# EAGLE schematic Accumulator Control Unit rev6 (EAGLE 9.6.2)

## Sheet 1 of 6: Connectors, Power Fusing, TSAL
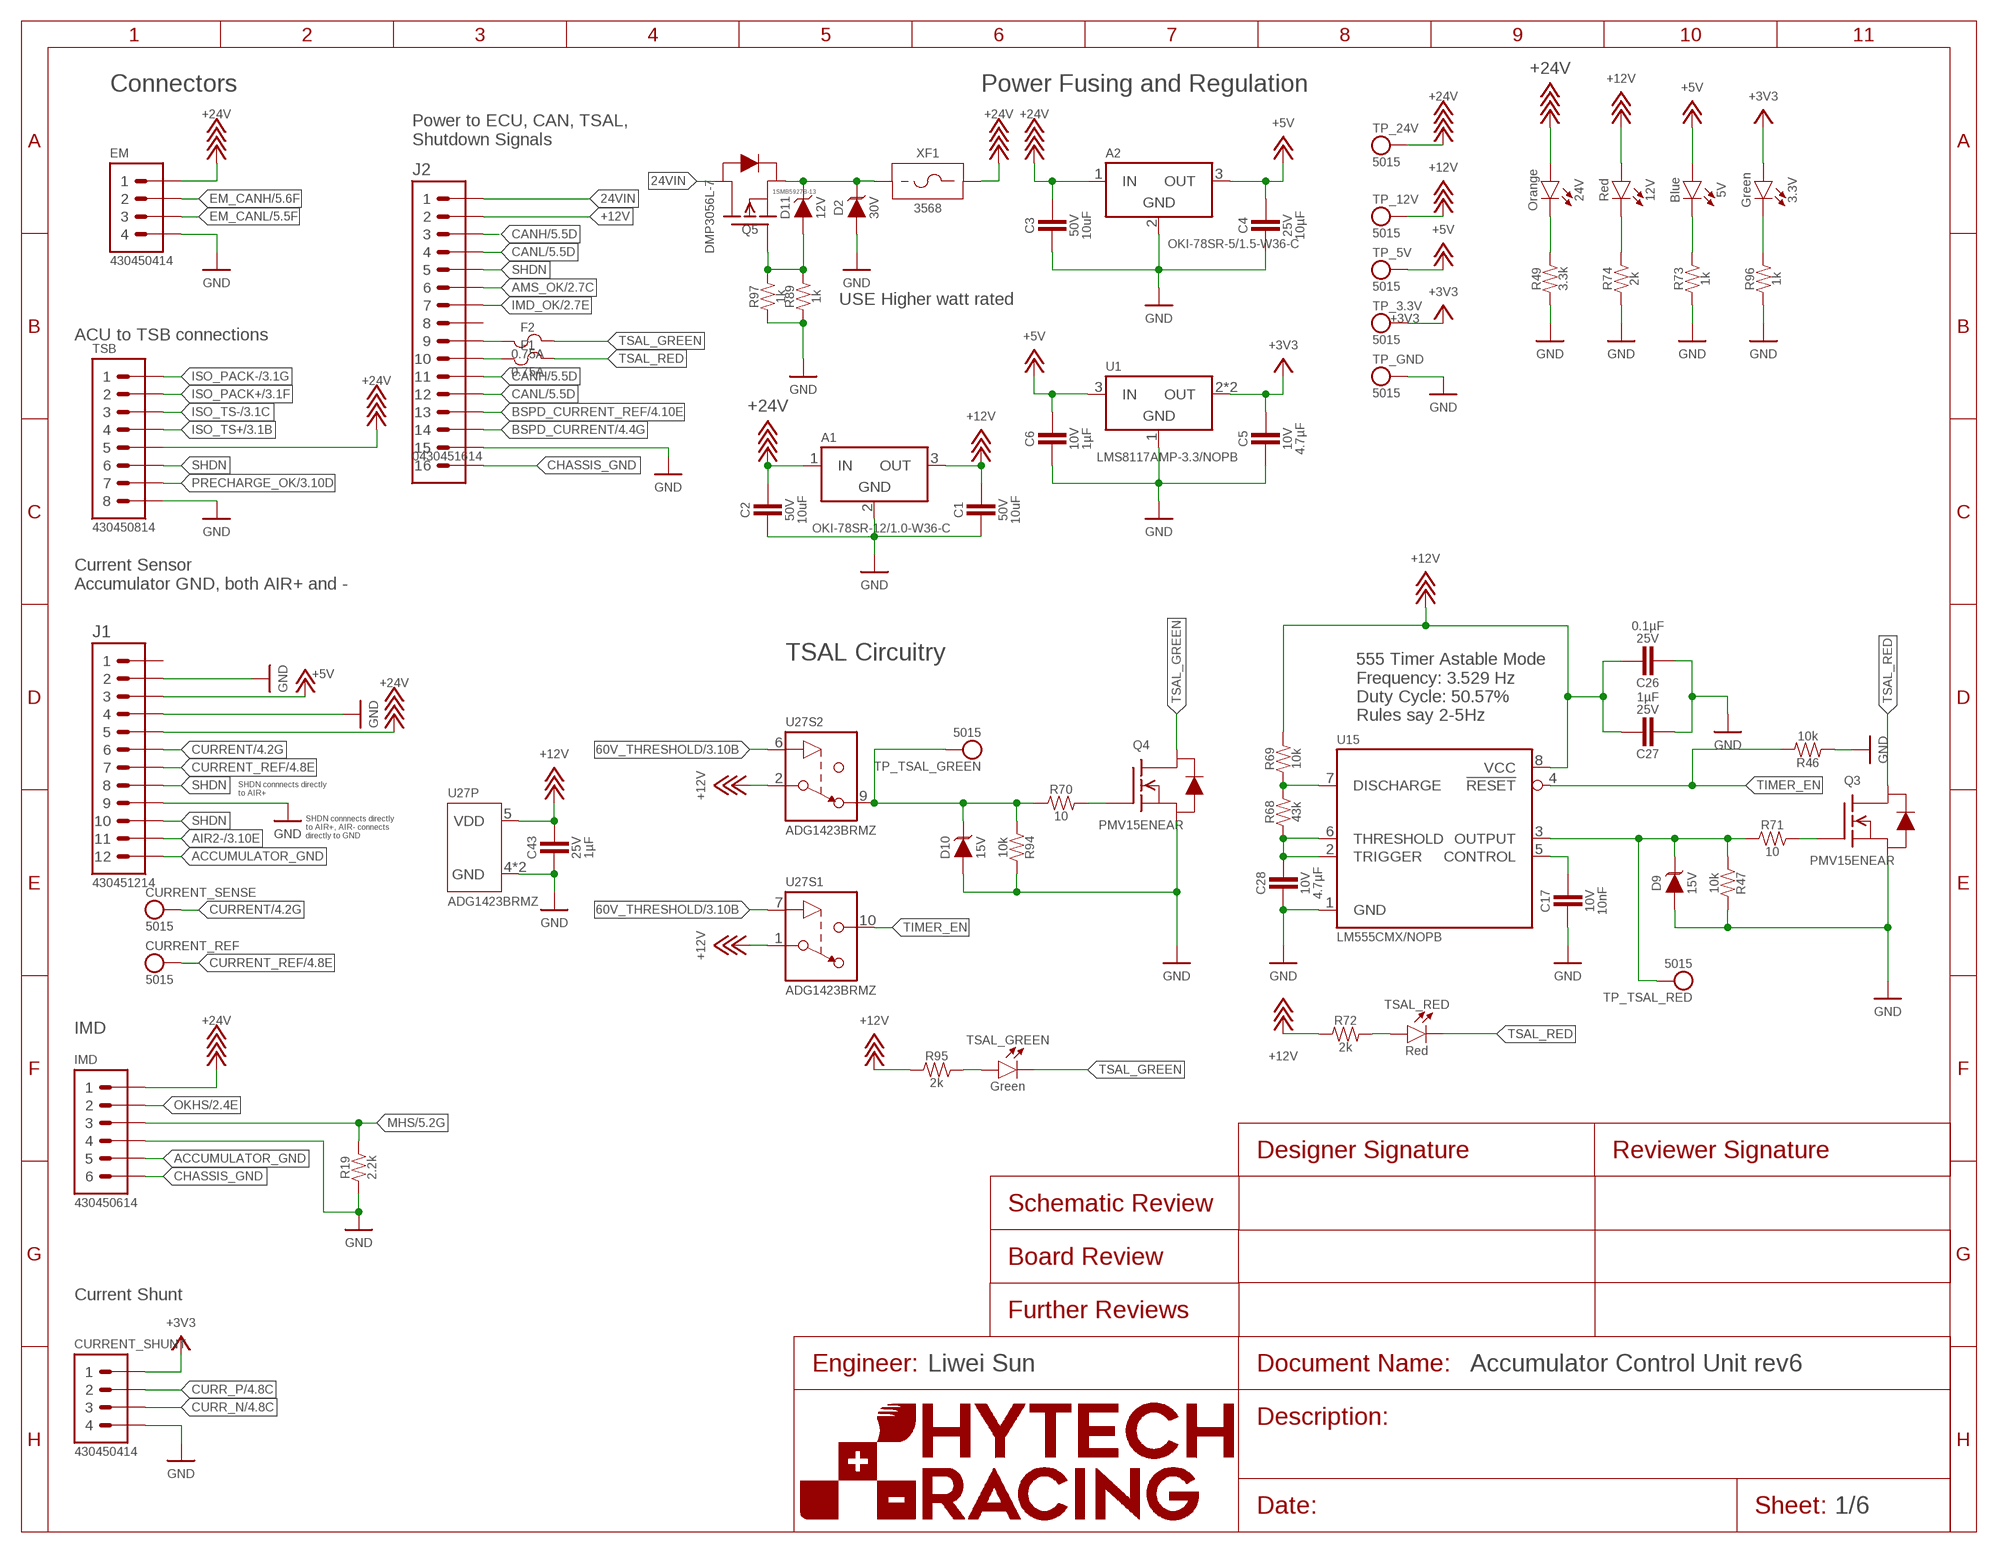
[diagram p0: schematic, sheet 1]
FRAME1 (FRAME): ENGINEER: Liwei Sun

### Parts
3.3V  LED_0603_GREEN  [0603-LED]
5V  LED_0603_BLUE  [0603-LED]
12V  LED_0603_RED  [0603-LED]
24V  LED_0603_ORANGE  [0603-LED]
A1  VOLTAGE_REGULATOR_MODULE_OKI-78SR_12V  [OKI-78SR]
A2  VOLTAGE_REGULATOR_MODULE_OKI-78SR_5V  [OKI-78SR]
C1  CAPACITOR_0805_50V_10UF  [0805-CAP]
C2  CAPACITOR_0805_50V_10UF  [0805-CAP]
C3  CAPACITOR_0805_50V_10UF  [0805-CAP]
C4  CAPACITOR_0603_25V_10UF  [0603-CAP]
C5  CAPACITOR_0603_10V_4.7UF  [0603-CAP]
C6  CAPACITOR_0603_10V_1UF  [0603-CAP]
C17  CAPACITOR_0603_10V_10NF  [0603-CAP]
C26  CAPACITOR_0603_25V_0.1UF  [0603-CAP]
C27  CAPACITOR_0603_25V_1UF  [0603-CAP]
C28  CAPACITOR_0603_10V_4.7UF  [0603-CAP]
C43  CAPACITOR_0603_25V_1UF  [0603-CAP]
CURRENT_REF  TEST_POINT  [MICRO_MINIATURE]
CURRENT_SENSE  TEST_POINT  [MICRO_MINIATURE]
CURRENT_SHUNT  CONNECTOR-4_μF_T_V_BLACK  [MOLEX_MICROFIT_PTH_VERTICAL_04_DUAL]
D2  TVS_DO-214AA_30V  [DO-214AA]
D9  TVS__15V  [SOT-23]
D10  TVS__15V  [SOT-23]
D11  ZENER_1.5SMBJ_12V  [1.5SMBJ]
EM  CONNECTOR-4_μF_T_V_BLACK  [MOLEX_MICROFIT_PTH_VERTICAL_04_DUAL]
F1  FUSE_0603_.75A  [0603-FUSE]
F2  FUSE_0603_.75A  [0603-FUSE]
IMD  CONNECTOR-6_μF_T_V_BLACK  [MOLEX_MICROFIT_PTH_VERTICAL_06_DUAL]
J1  CONNECTOR-12_MF_T_V_  [MOLEX_MICROFIT_PTH_VERTICAL_12_DUAL]
J2  CONNECTOR-16_MF_T_V_  [MOLEX_MICROFIT_PTH_VERTICAL_16_DUAL]
Q3  TRANSISTOR_N_MOS__PMV15ENEA  [SOT-23]
Q4  TRANSISTOR_N_MOS__PMV15ENEA  [SOT-23]
Q5  TRANSISTOR_P_MOS_SOT-23_DMP3056L-7  [SOT-23]
R19  RESISTOR_0603_2.2K  [0603-RES]
R46  RESISTOR_0603_10K  [0603-RES]
R47  RESISTOR_0603_10K  [0603-RES]
R49  RESISTOR_0603_3.3K  [0603-RES]
R68  RESISTOR_0603_43K  [0603-RES]
R69  RESISTOR_0603_10K  [0603-RES]
R70  RESISTOR_0603_10  [0603-RES]
R71  RESISTOR_0603_10  [0603-RES]
R72  RESISTOR_0603_2K  [0603-RES]
R73  RESISTOR_0603_1K  [0603-RES]
R74  RESISTOR_0603_2K  [0603-RES]
R89  RESISTOR_0603_1K  [0603-RES]
R94  RESISTOR_0603_10K  [0603-RES]
R95  RESISTOR_0603_2K  [0603-RES]
R96  RESISTOR_0603_1K  [0603-RES]
R97  RESISTOR_0603_1K  [0603-RES]
TP_3.3V  TEST_POINT  [5015]
TP_5V  TEST_POINT  [5015]
TP_12V  TEST_POINT  [5015]
TP_24V  TEST_POINT  [5015]
TP_GND  TEST_POINT  [5015]
TP_TSAL_GREEN  TEST_POINT  [MICRO_MINIATURE]
TP_TSAL_RED  TEST_POINT  [MICRO_MINIATURE]
TSAL_GREEN  LED_0603_GREEN  [0603-LED]
TSAL_RED  LED_0603_RED  [0603-LED]
TSB  CONNECTOR-8_μF_T_V_BLACK  [MOLEX_MICROFIT_PTH_VERTICAL_08_DUAL]
U1  VOLTAGE_REGULATOR_SOT-223_3.3V  [SOT-223]
U15  LM555  [SOIC-08(NARROW,0.15")]
U27  ADG1423  [MSOP-10]
XF1  FUSE_HOLDER_MINIBLADEPTH  [3568]

### Nets
24VIN: J2.1 Q5.3(D)
60V_THRESHOLD: U27.6(S2:IN) U27.7(S1:IN) ; also sheet 3
+3V3: 3.3V.2(A) C5.1 CURRENT_SHUNT.1 TP_3.3V.1 U1.2(OUT) U1.4(OUT) ; also sheet 4,5
+5V: 5V.2(A) A2.3(OUT) C4.1 C6.1 J1.3 TP_5V.1 U1.3(IN) ; also sheet 3,5
+12V: 12V.2(A) A1.3(OUT) C1.1 C26.1 C27.1 C43.1 J2.2 R69.2 R72.1 R95.1 TP_12V.1 U15.8(VCC) U27.1(S1:S) U27.2(S2:S) U27.5(P:VDD) ; also sheet 4
+24V: 24V.2(A) A1.1(IN) A2.1(IN) C2.1 C3.1 EM.1 IMD.1 J1.5 TP_24V.1 TSB.5 XF1.3 XF1.4 ; also sheet 2,4,5
ACCUMULATOR_GND: IMD.5 J1.12
AIR2-: J1.11 ; also sheet 3
AMS_OK: J2.6 ; also sheet 2
BSPD_CURRENT: J2.14 ; also sheet 4,5
BSPD_CURRENT_REF: J2.13 ; also sheet 4
CANH: J2.3 J2.11 ; also sheet 5
CANL: J2.4 J2.12 ; also sheet 5
CHASSIS_GND: IMD.6 J2.16
CURR_N: CURRENT_SHUNT.3 ; also sheet 4
CURR_P: CURRENT_SHUNT.2 ; also sheet 4
CURRENT: CURRENT_SENSE.1 J1.6 ; also sheet 4
CURRENT_REF: CURRENT_REF.1 J1.7 ; also sheet 4
EM_CANH: EM.2 ; also sheet 5
EM_CANL: EM.3 ; also sheet 5
GND: A1.2(GND) A2.2(GND) C1.2 C2.2 C3.2 C4.2 C5.2 C6.2 C17.2 C26.2 C27.2 C28.2 C43.2 CURRENT_SHUNT.4 D2.1(A) D9.1(A) D10.1(A) EM.4 IMD.4 J1.2 J1.4 J1.9 J2.15 Q3.2(S) Q4.2(S) R19.1 R46.1 R47.2 R49.1 R73.1 R74.1 R89.1 R94.2 R96.1 R97.1 TP_GND.1 TSB.8 U1.1(GND) U15.1(GND) U27.4(P:GND) U27.8(P:GND) ; also sheet 2,3,4,5
IMD_OK: J2.7 ; also sheet 2,5
ISO_PACK+: TSB.2 ; also sheet 3
ISO_PACK-: TSB.1 ; also sheet 3
ISO_TS+: TSB.4 ; also sheet 3
ISO_TS-: TSB.3 ; also sheet 3
MHS: IMD.3 R19.2 ; also sheet 5
N$1: 3.3V.1(C) R96.2
N$2: 5V.1(C) R73.2
N$3: C28.1 R68.1 U15.2(TRIGGER) U15.6(THRESHOLD)
N$5: C17.1 U15.5(CONTROL)
N$6: R68.2 R69.1 U15.7(DISCHARGE)
N$14: 12V.1(C) R74.2
N$18: D10.3(C) R70.1 R94.1 TP_TSAL_GREEN.1 U27.9(S2:D)
N$19: D9.3(C) R47.1 R71.1 TP_TSAL_RED.1 U15.3(OUTPUT)
N$24: R95.2 TSAL_GREEN.2(A)
N$28: F1.1 J2.10
N$31: F2.1 J2.9
N$32: 24V.1(C) R49.2
N$46: R72.2 TSAL_RED.2(A)
N$60: Q3.1(G) R71.2
N$61: Q4.1(G) R70.2
N$75: D2.2(C) D11.2(C) Q5.2(S) XF1.1 XF1.2
N$76: D11.1(A) Q5.1(G) R89.2 R97.2
OKHS: IMD.2 ; also sheet 2
PRECHARGE_OK: TSB.7 ; also sheet 3,5
SHDN: J1.8 J1.10 J2.5 TSB.6
TIMER_EN: R46.2 U15.4(!RESET) U27.10(S1:D)
TSAL_GREEN: F2.2 Q4.3(D) TSAL_GREEN.1(C)
TSAL_RED: F1.2 Q3.3(D) TSAL_RED.1(C)
Unconnected: J1.1 J2.8

### Notes on the sheet
- Connectors | Power Fusing and Regulation
- Power to ECU, CAN, TSAL, 
  Shutdown Signals
- USE Higher watt rated
- ACU to TSB connections
- Current Sensor
  Accumulator GND, both AIR+ and -
- TSAL Circuitry
- 555 Timer Astable Mode
  Frequency: 3.529 Hz
  Duty Cycle: 50.57%
  Rules say 2-5Hz
- SHDN connnects directly
  to AIR+
- SHDN connnects directly
  to AIR+, AIR- connects
  directly to GND
- IMD
- Current Shunt

## Sheet 2 of 6: Shutdown Circuitry
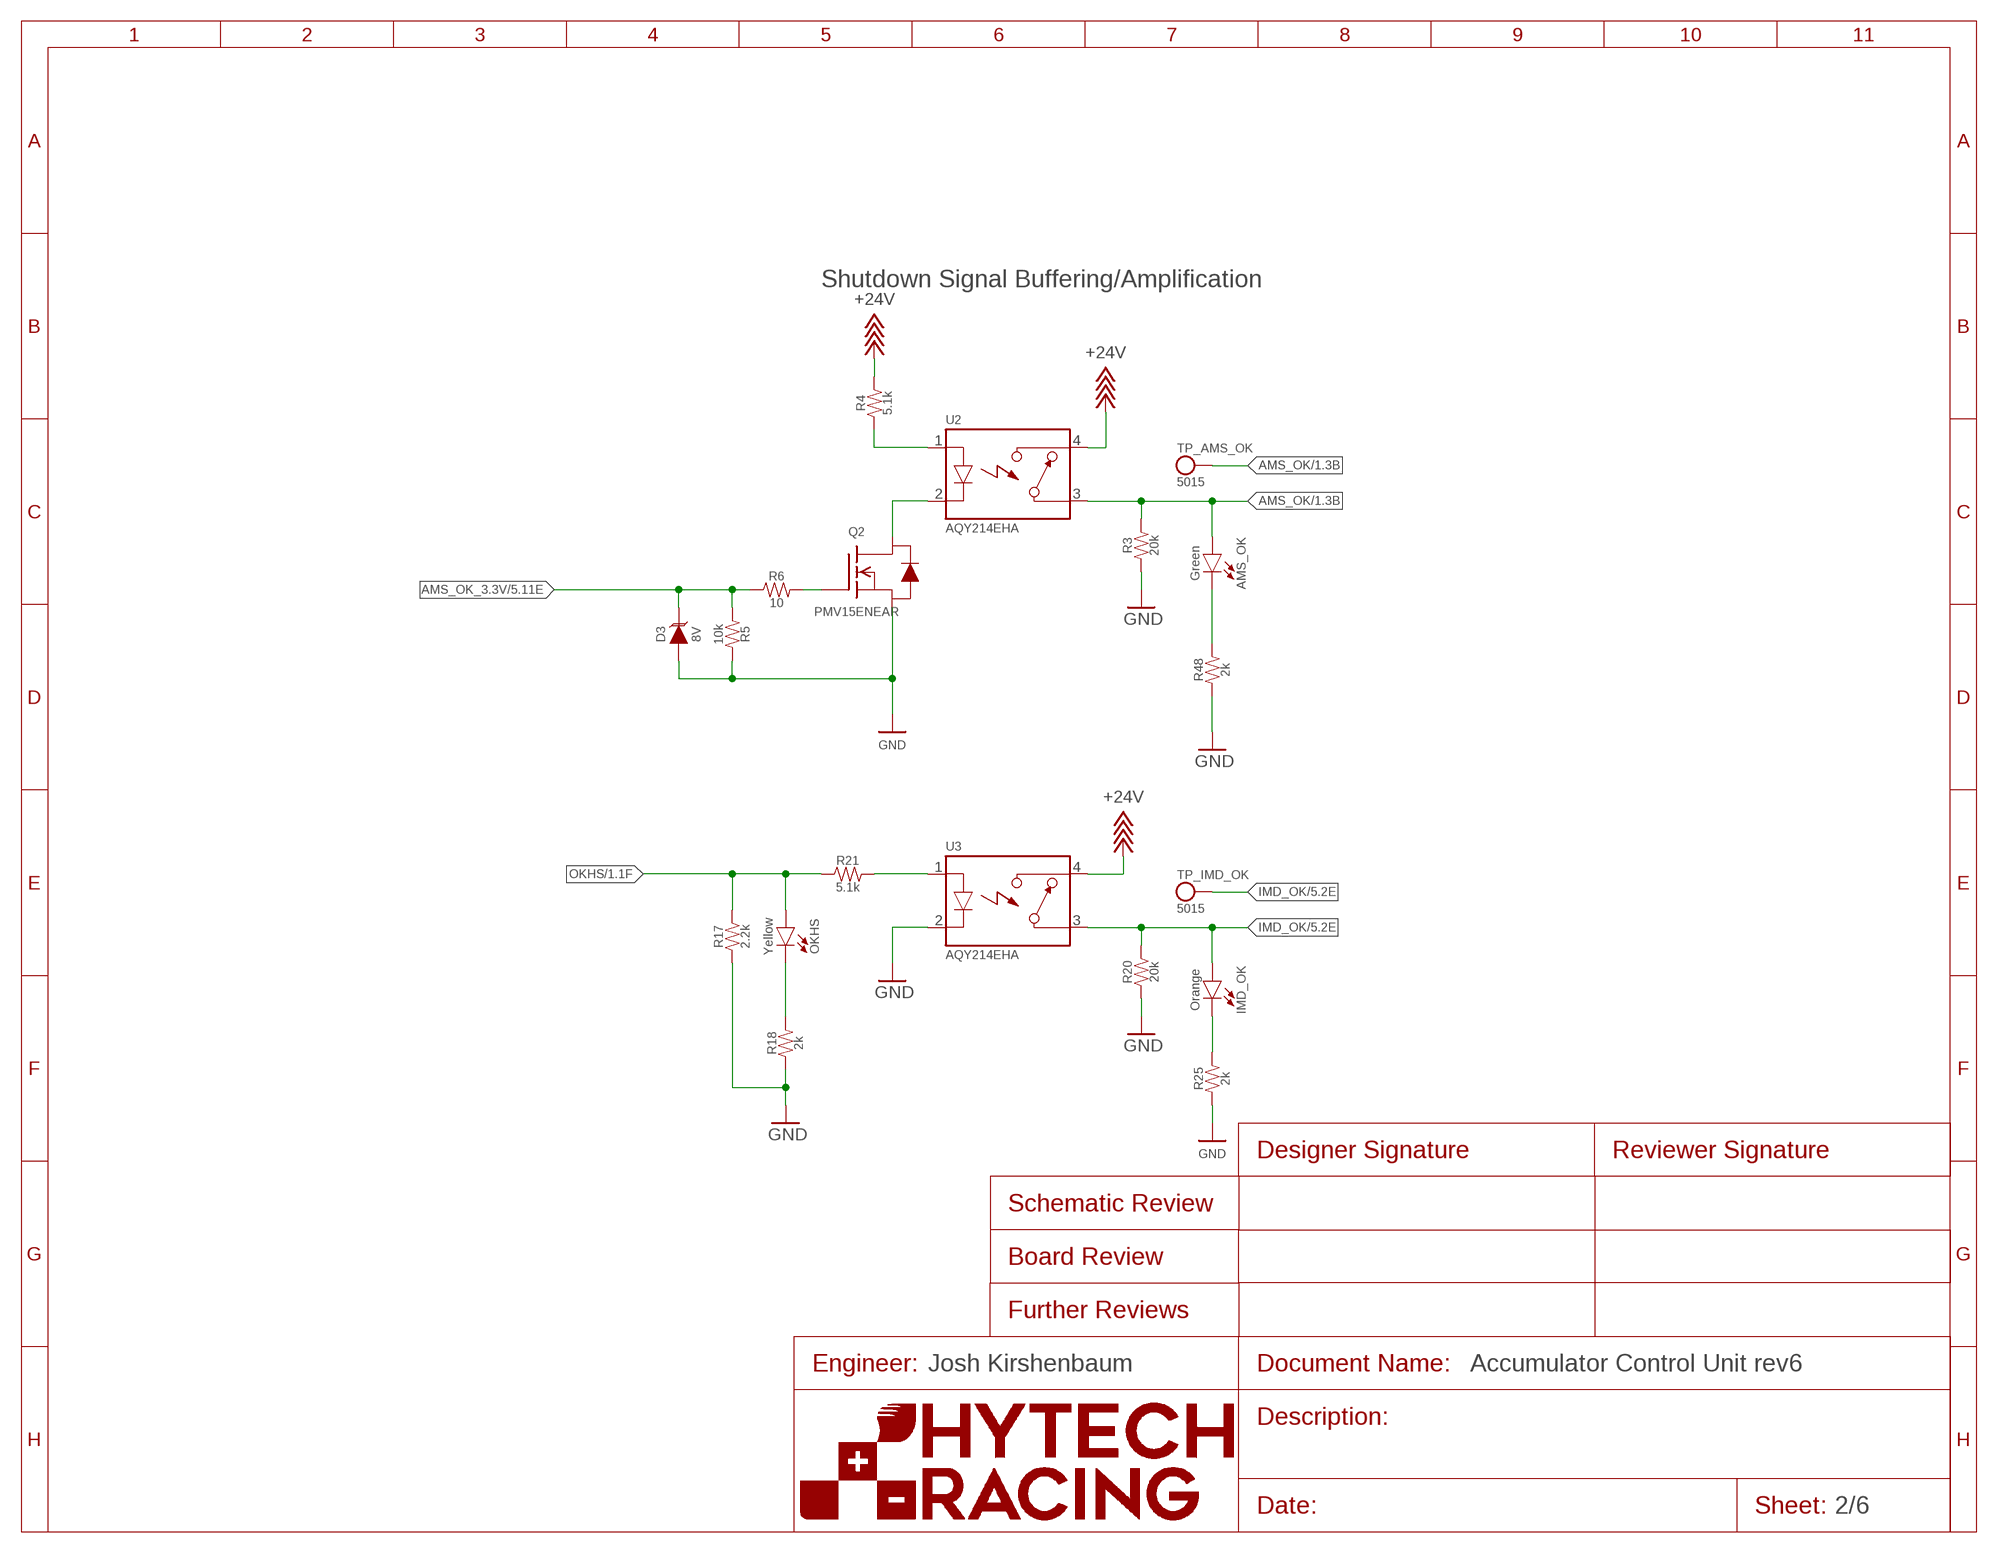
[diagram p1: schematic, sheet 2]

### Parts
AMS_OK  LED_0603_GREEN  [0603-LED]
D3  TVS__8V  [SOT-23]
IMD_OK  LED_0603_ORANGE  [0603-LED]
OKHS  LED_0603_YELLOW  [0603-LED]
Q2  TRANSISTOR_N_MOS__PMV15ENEA  [SOT-23]
R3  RESISTOR_0603_20K  [0603-RES]
R4  RESISTOR_0603_5.1K  [0603-RES]
R5  RESISTOR_0603_10K  [0603-RES]
R6  RESISTOR_0603_10  [0603-RES]
R17  RESISTOR_0603_2.2K  [0603-RES]
R18  RESISTOR_0603_2K  [0603-RES]
R20  RESISTOR_0603_20K  [0603-RES]
R21  RESISTOR_0603_5.1K  [0603-RES]
R25  RESISTOR_0603_2K  [0603-RES]
R48  RESISTOR_0603_2K  [0603-RES]
TP_AMS_OK  TEST_POINT  [MICRO_MINIATURE]
TP_IMD_OK  TEST_POINT  [MICRO_MINIATURE]
U2  RELAY_SOLIDSTATE_NO_DIP-4  [DIP-4]
U3  RELAY_SOLIDSTATE_NO_DIP-4  [DIP-4]

### Nets
+24V: R4.2 U2.4(CONTACT2) U3.4(CONTACT2) ; also sheet 1,4,5
AMS_OK: AMS_OK.2(A) R3.2 TP_AMS_OK.1 U2.3(CONTACT1) ; also sheet 1
AMS_OK_3.3V: D3.3(C) R5.1 R6.1 ; also sheet 5
GND: D3.1(A) Q2.2(S) R3.1 R5.2 R17.1 R18.1 R20.1 R25.1 R48.1 U3.2(CONTROL-) ; also sheet 1,3,4,5
IMD_OK: IMD_OK.2(A) R20.2 TP_IMD_OK.1 U3.3(CONTACT1) ; also sheet 1,5
N$8: R21.2 U3.1(CONTROL+)
N$9: OKHS.1(C) R18.2
N$16: R4.1 U2.1(CONTROL+)
N$17: AMS_OK.1(C) R48.2
N$20: Q2.3(D) U2.2(CONTROL-)
N$27: IMD_OK.1(C) R25.2
N$30: Q2.1(G) R6.2
OKHS: OKHS.2(A) R17.2 R21.1 ; also sheet 1

### Notes on the sheet
- Shutdown Signal Buffering/Amplification
- Josh Kirshenbaum

## Sheet 3 of 6: Precharge Circuit
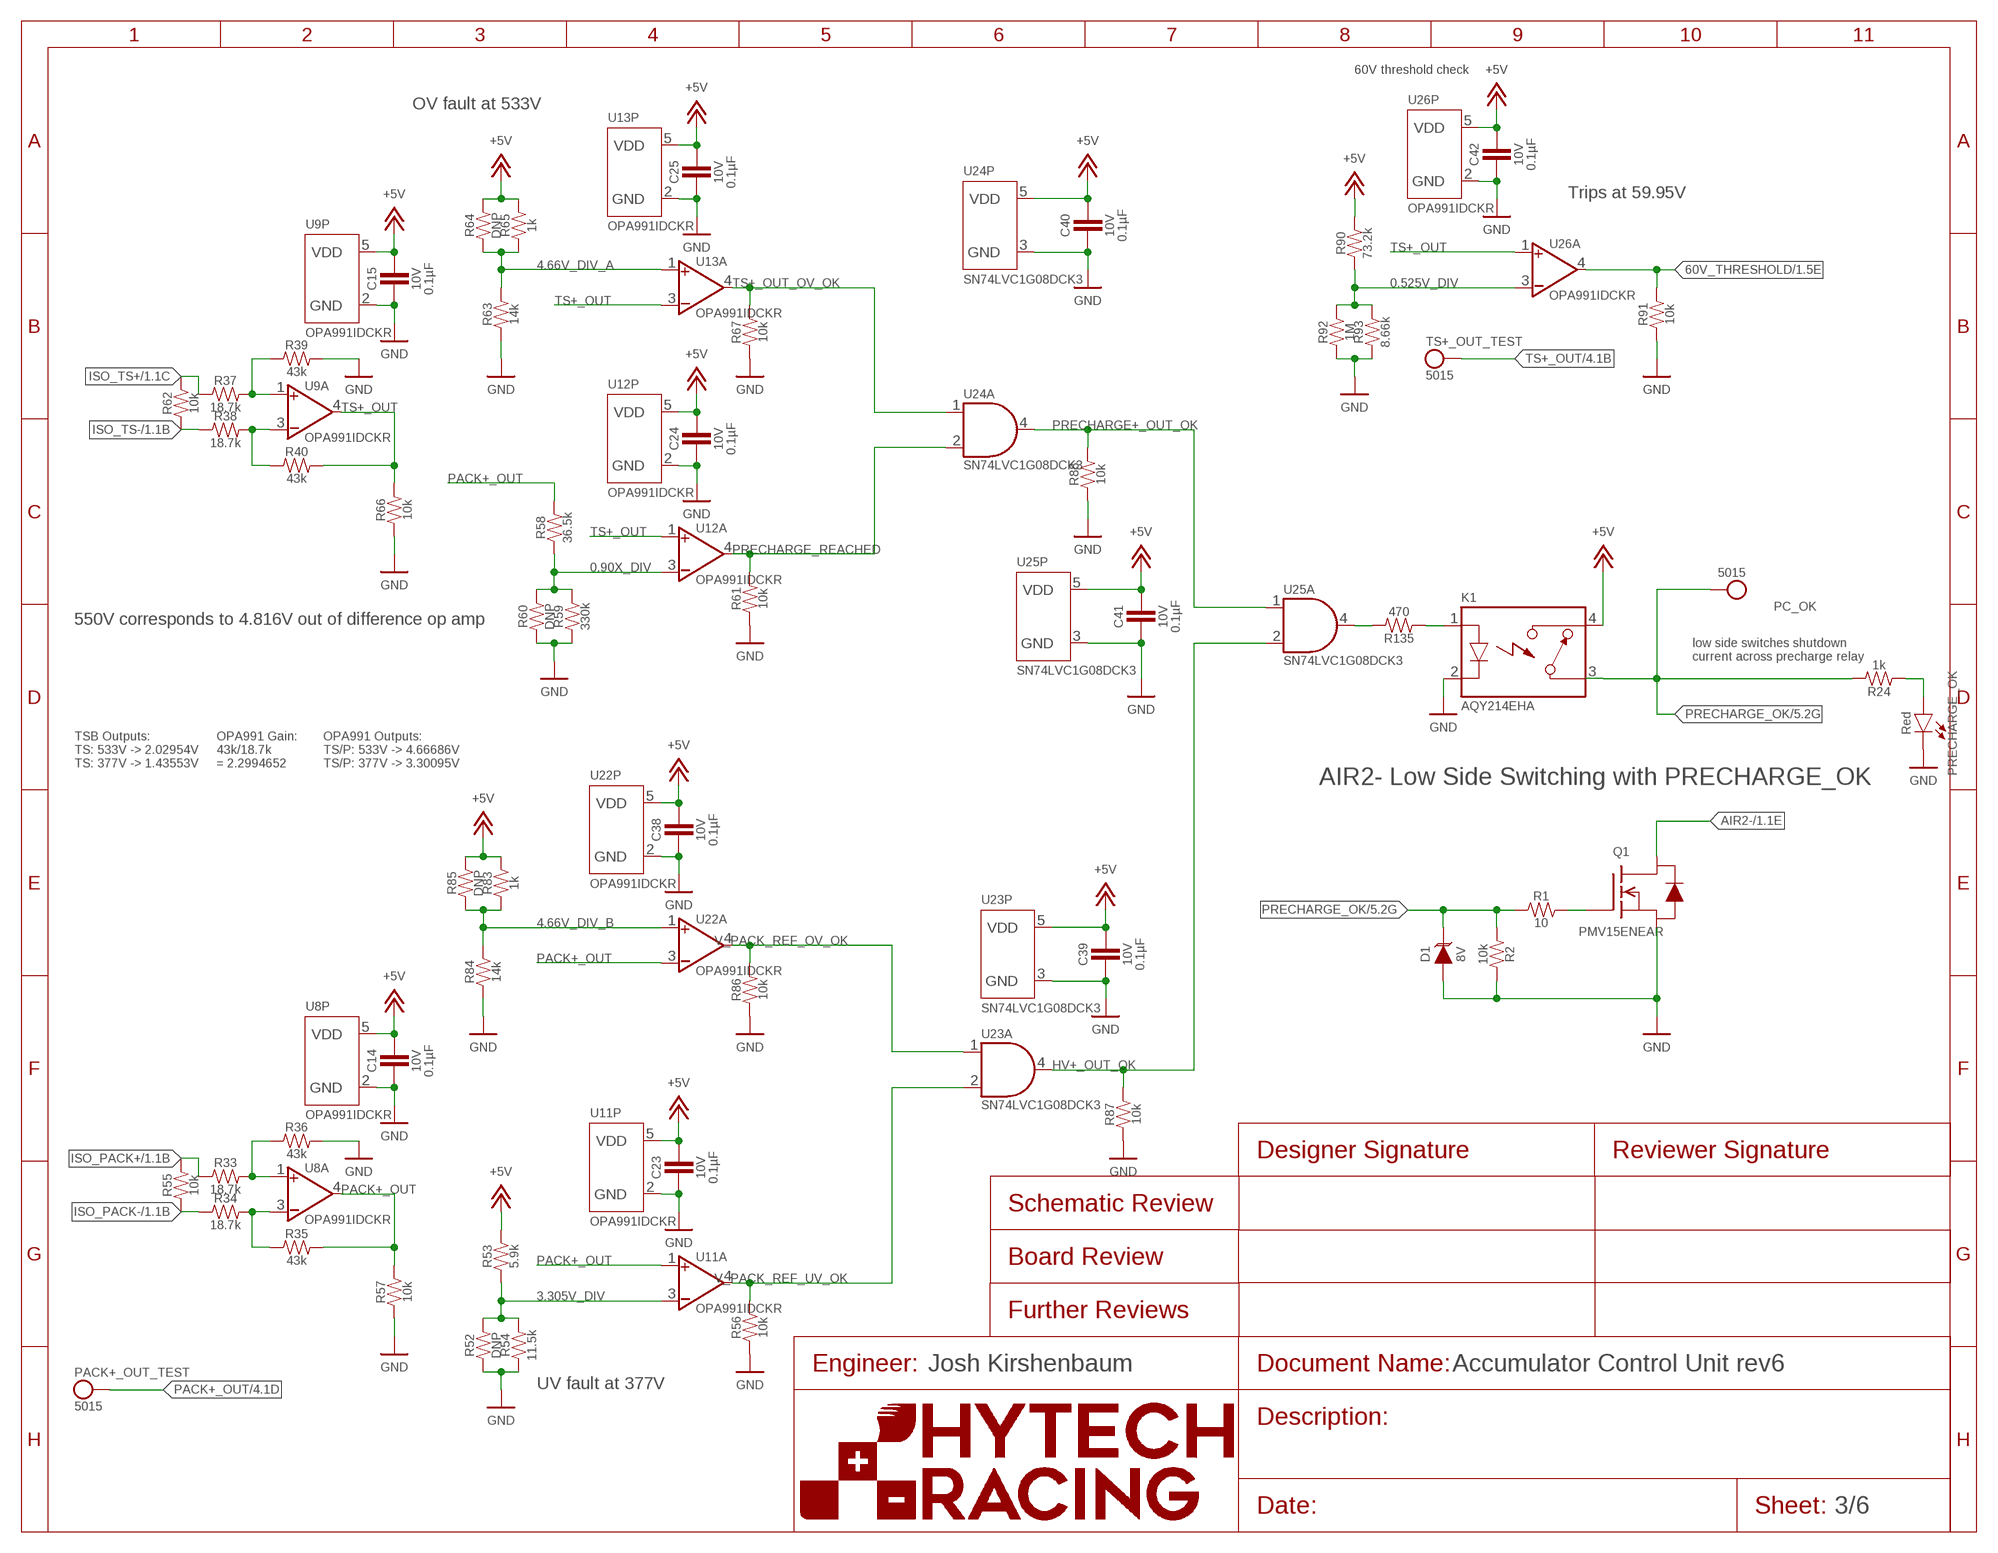
[diagram p2: schematic, sheet 3]

### Parts
C14  CAPACITOR_0603_10V_0.1UF  [0603-CAP]
C15  CAPACITOR_0603_10V_0.1UF  [0603-CAP]
C23  CAPACITOR_0603_10V_0.1UF  [0603-CAP]
C24  CAPACITOR_0603_10V_0.1UF  [0603-CAP]
C25  CAPACITOR_0603_10V_0.1UF  [0603-CAP]
C38  CAPACITOR_0603_10V_0.1UF  [0603-CAP]
C39  CAPACITOR_0603_10V_0.1UF  [0603-CAP]
C40  CAPACITOR_0603_10V_0.1UF  [0603-CAP]
C41  CAPACITOR_0603_10V_0.1UF  [0603-CAP]
C42  CAPACITOR_0603_10V_0.1UF  [0603-CAP]
D1  TVS__8V  [SOT-23]
K1  RELAY_SOLIDSTATE_NO_DIP-4  [DIP-4]
PACK+_OUT_TEST  TEST_POINT  [MICRO_MINIATURE]
PC_OK  TEST_POINT  [MICRO_MINIATURE]
PRECHARGE_OK  LED_0603_RED  [0603-LED]
Q1  TRANSISTOR_N_MOS__PMV15ENEA  [SOT-23]
R1  RESISTOR_0603_10  [0603-RES]
R2  RESISTOR_0603_10K  [0603-RES]
R24  RESISTOR_0603_1K  [0603-RES]
R33  RESISTOR_0603_18.7K_LT  [0603-RES]
R34  RESISTOR_0603_18.7K_LT  [0603-RES]
R35  RESISTOR_0603_43K_LT  [0603-RES]
R36  RESISTOR_0603_43K_LT  [0603-RES]
R37  RESISTOR_0603_18.7K_LT  [0603-RES]
R38  RESISTOR_0603_18.7K_LT  [0603-RES]
R39  RESISTOR_0603_43K_LT  [0603-RES]
R40  RESISTOR_0603_43K_LT  [0603-RES]
R52  RESISTOR_0603_DNP  [0603-RES]
R53  RESISTOR_0603_5.9K  [0603-RES]
R54  RESISTOR_0603_11.5K  [0603-RES]
R55  RESISTOR_0603_10K  [0603-RES]
R56  RESISTOR_0603_10K  [0603-RES]
R57  RESISTOR_0603_10K  [0603-RES]
R58  RESISTOR_0603_36.5K  [0603-RES]
R59  RESISTOR_0603_330K  [0603-RES]
R60  RESISTOR_0603_DNP  [0603-RES]
R61  RESISTOR_0603_10K  [0603-RES]
R62  RESISTOR_0603_10K  [0603-RES]
R63  RESISTOR_0603_14K  [0603-RES]
R64  RESISTOR_0603_DNP  [0603-RES]
R65  RESISTOR_0603_1K  [0603-RES]
R66  RESISTOR_0603_10K  [0603-RES]
R67  RESISTOR_0603_10K  [0603-RES]
R83  RESISTOR_0603_1K  [0603-RES]
R84  RESISTOR_0603_14K  [0603-RES]
R85  RESISTOR_0603_DNP  [0603-RES]
R86  RESISTOR_0603_10K  [0603-RES]
R87  RESISTOR_0603_10K  [0603-RES]
R88  RESISTOR_0603_10K  [0603-RES]
R90  RESISTOR_0603_73.2K  [0603-RES]
R91  RESISTOR_0603_10K  [0603-RES]
R92  RESISTOR_0603_1M  [0603-RES]
R93  RESISTOR_0603_8.66K  [0603-RES]
R135  RESISTOR_0603_470  [0603-RES]
TS+_OUT_TEST  TEST_POINT  [MICRO_MINIATURE]
U8  OPAMP_1_CHANNEL_OPA991  [SC-70-5]
U9  OPAMP_1_CHANNEL_OPA991  [SC-70-5]
U11  OPAMP_1_CHANNEL_OPA991  [SC-70-5]
U12  OPAMP_1_CHANNEL_OPA991  [SC-70-5]
U13  OPAMP_1_CHANNEL_OPA991  [SC-70-5]
U22  OPAMP_1_CHANNEL_OPA991  [SC-70-5]
U23  LOGICGATE_AND_DCK3  [SC-70-5]
U24  LOGICGATE_AND_DCK3  [SC-70-5]
U25  LOGICGATE_AND_DCK3  [SC-70-5]
U26  OPAMP_1_CHANNEL_OPA991  [SC-70-5]

### Nets
0.90X_DIV: R58.1 R59.2 R60.2 U12.3(A:VIN-)
0.525V_DIV: R90.1 R92.2 R93.2 U26.3(A:VIN-)
3.305V_DIV: R52.2 R53.1 R54.2 U11.3(A:VIN-)
4.66V_DIV_A: R63.2 R64.1 R65.1 U13.1(A:VIN+)
4.66V_DIV_B: R83.1 R84.2 R85.1 U22.1(A:VIN+)
60V_THRESHOLD: R91.2 U26.4(A:VOUT) ; also sheet 1
+5V: C14.1 C15.1 C23.1 C24.1 C25.1 C38.1 C39.1 C40.1 C41.1 C42.1 K1.4(CONTACT2) R53.2 R64.2 R65.2 R83.2 R85.2 R90.2 U8.5(P:VDD) U9.5(P:VDD) U11.5(P:VDD) U12.5(P:VDD) U13.5(P:VDD) U22.5(P:VDD) U23.5(P:VDD) U24.5(P:VDD) U25.5(P:VDD) U26.5(P:VDD) ; also sheet 1,5
AIR2-: Q1.3(D) ; also sheet 1
GND: C14.2 C15.2 C23.2 C24.2 C25.2 C38.2 C39.2 C40.2 C41.2 C42.2 D1.1(A) K1.2(CONTROL-) PRECHARGE_OK.1(C) Q1.2(S) R2.2 R36.2 R39.2 R52.1 R54.1 R56.1 R57.1 R59.1 R60.1 R61.1 R63.1 R66.1 R67.1 R84.1 R86.1 R87.1 R88.1 R91.1 R92.1 R93.1 U8.2(P:GND) U9.2(P:GND) U11.2(P:GND) U12.2(P:GND) U13.2(P:GND) U22.2(P:GND) U23.3(P:GND) U24.3(P:GND) U25.3(P:GND) U26.2(P:GND) ; also sheet 1,2,4,5
HV+_OUT_OK: R87.2 U23.4(A:OUT) U25.2(A:IN2)
ISO_PACK+: R33.1 R55.2 ; also sheet 1
ISO_PACK-: R34.1 R55.1 ; also sheet 1
ISO_TS+: R37.1 R62.2 ; also sheet 1
ISO_TS-: R38.1 R62.1 ; also sheet 1
N$4: PRECHARGE_OK.2(A) R24.1
N$7: Q1.1(G) R1.2
N$10: R37.2 R39.1 U9.1(A:VIN+)
N$11: R38.2 R40.1 U9.3(A:VIN-)
N$22: R33.2 R36.1 U8.1(A:VIN+)
N$23: R34.2 R35.1 U8.3(A:VIN-)
N$35: K1.1(CONTROL+) R135.1
N$41: R135.2 U25.4(A:OUT)
PACK+_OUT: PACK+_OUT_TEST.1 R35.2 R57.2 R58.2 U8.4(A:VOUT) U11.1(A:VIN+) U22.3(A:VIN-) ; also sheet 4
PRECHARGE+_OUT_OK: R88.2 U24.4(A:OUT) U25.1(A:IN1)
PRECHARGE_OK: D1.3(C) K1.3(CONTACT1) PC_OK.1 R1.1 R2.1 R24.2 ; also sheet 1,5
PRECHARGE_REACHED: R61.2 U12.4(A:VOUT) U24.2(A:IN2)
TS+_OUT: R40.2 R66.2 TS+_OUT_TEST.1 U9.4(A:VOUT) U12.1(A:VIN+) U13.3(A:VIN-) U26.1(A:VIN+) ; also sheet 4
TS+_OUT_OV_OK: R67.2 U13.4(A:VOUT) U24.1(A:IN1)
V_PACK_REF_OV_OK: R86.2 U22.4(A:VOUT) U23.1(A:IN1)
V_PACK_REF_UV_OK: R56.2 U11.4(A:VOUT) U23.2(A:IN2)

### Notes on the sheet
- 60V threshold check
- OV fault at 533V
- Trips at 59.95V
- 550V corresponds to 4.816V out of difference op amp
- low side switches shutdown 
  current across precharge relay
- TSB Outputs:
  TS: 533V -> 2.02954V
  TS: 377V -> 1.43553V
- OPA991 Gain:
  43k/18.7k 
  = 2.2994652
- OPA991 Outputs:
  TS/P: 533V -> 4.66686V
  TS/P: 377V -> 3.30095V
- AIR2- Low Side Switching with PRECHARGE_OK
- Josh Kirshenbaum
- UV fault at 377V

## Sheet 4 of 6: Analog Filtering
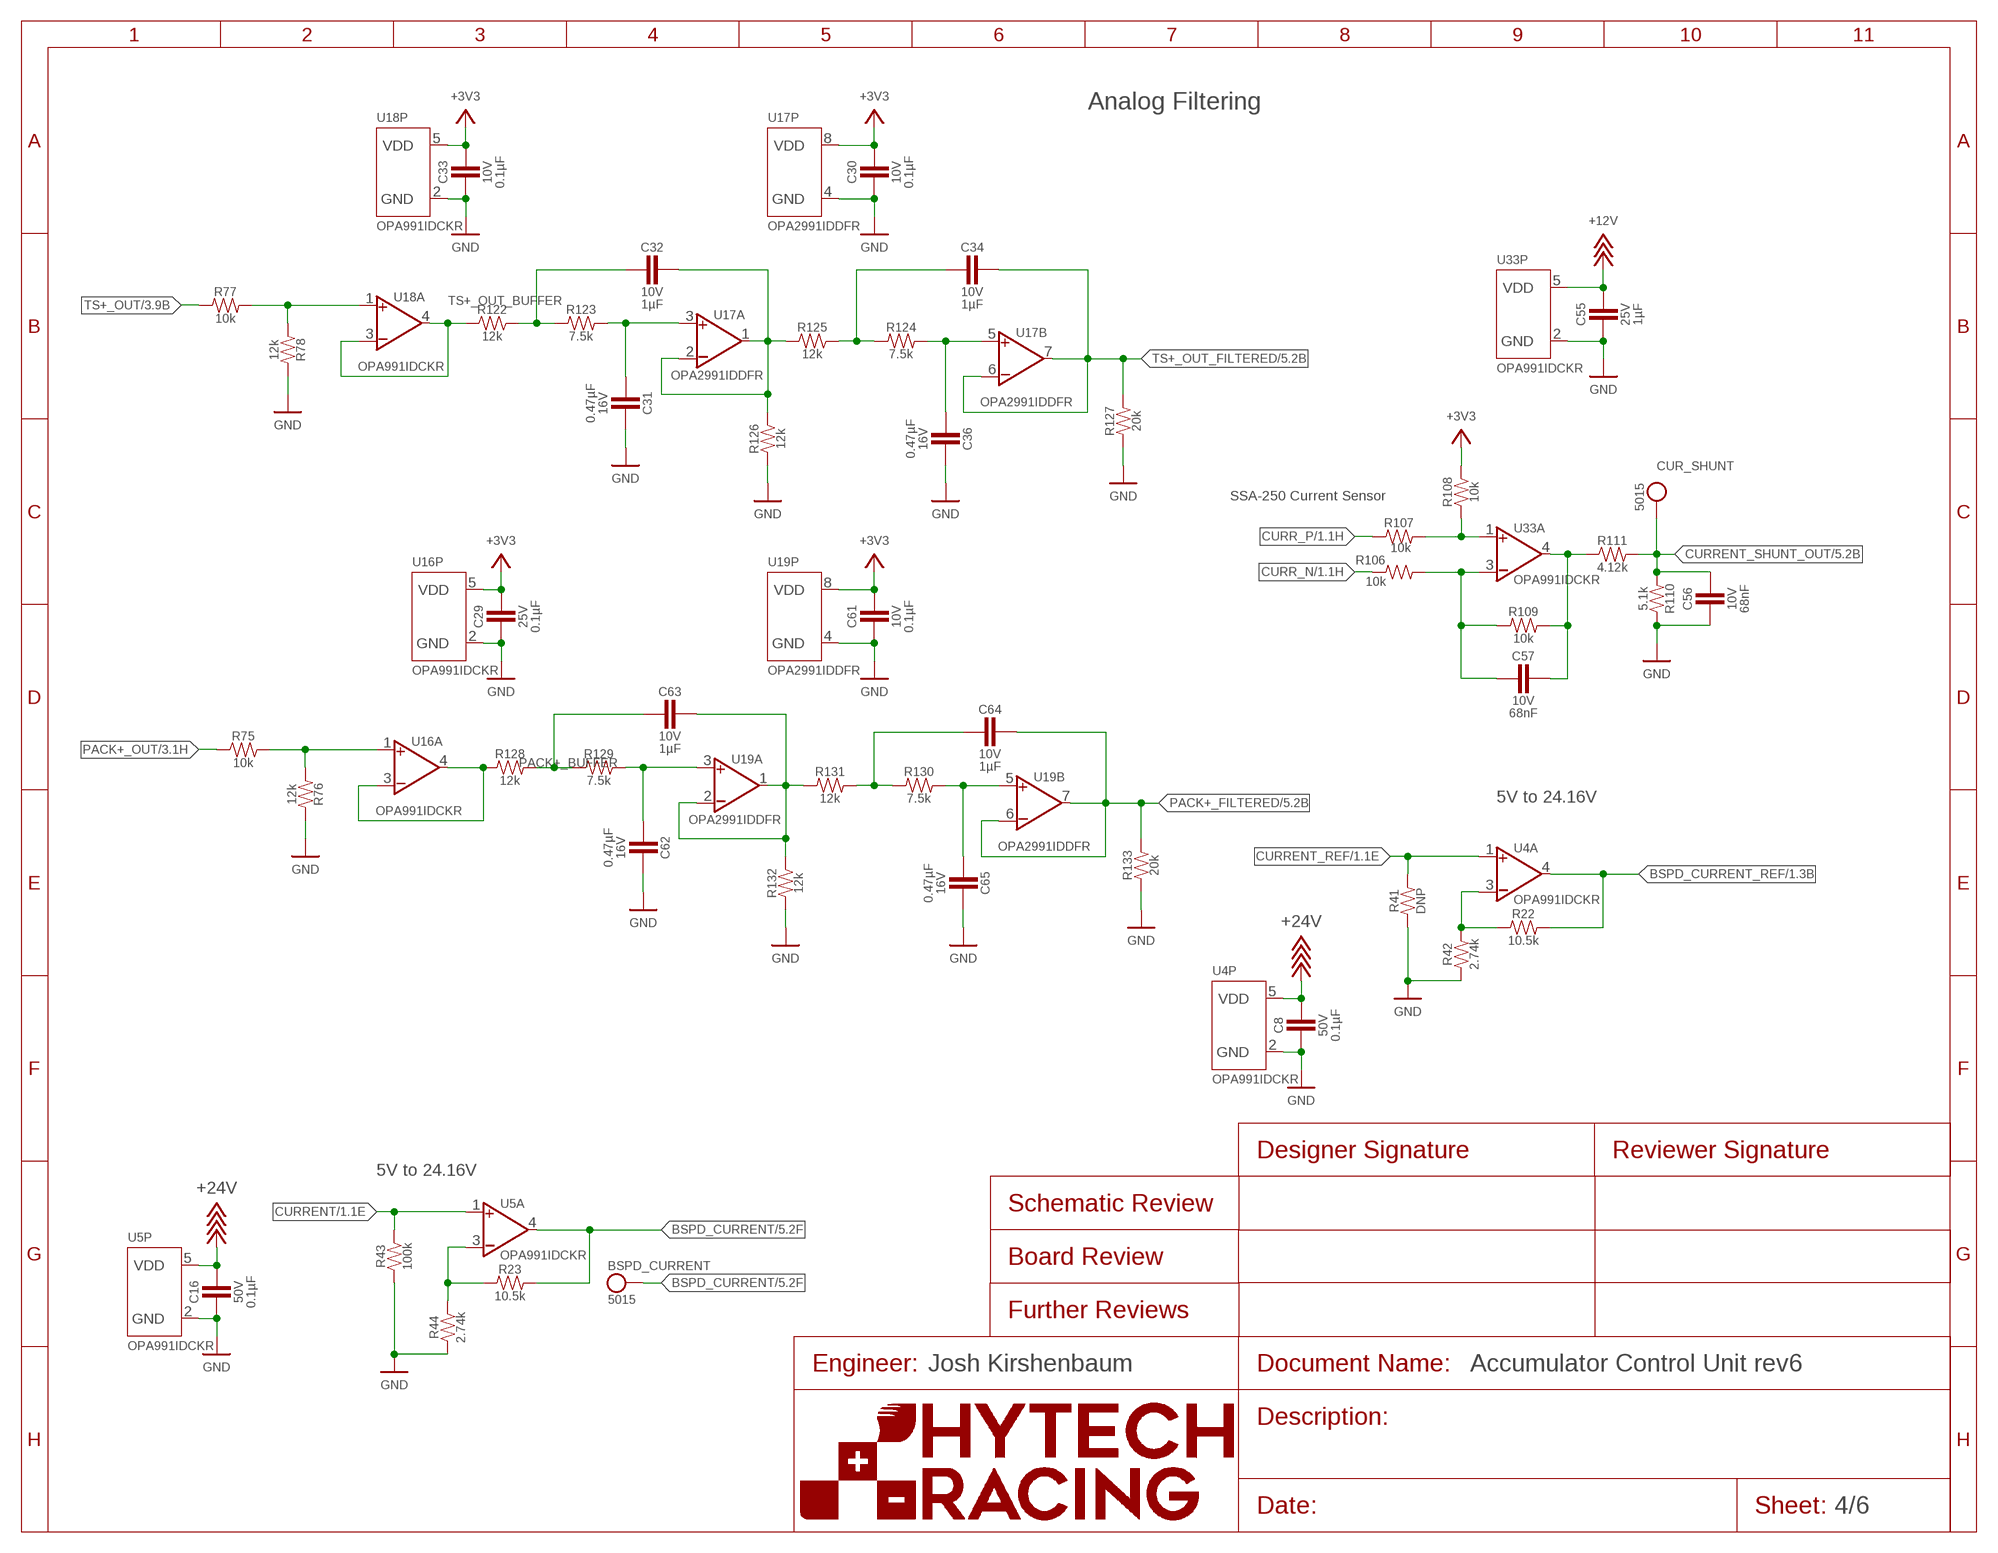
[diagram p3: schematic, sheet 4]

### Parts
BSPD_CURRENT  TEST_POINT  [MICRO_MINIATURE]
C8  CAPACITOR_0603_50V_0.1UF  [0603-CAP]
C16  CAPACITOR_0603_50V_0.1UF  [0603-CAP]
C29  CAPACITOR_0603_25V_0.1UF  [0603-CAP]
C30  CAPACITOR_0603_10V_0.1UF  [0603-CAP]
C31  CAPACITOR_0603_16V_0.47UF  [0603-CAP]
C32  CAPACITOR_0603_10V_1UF  [0603-CAP]
C33  CAPACITOR_0603_10V_0.1UF  [0603-CAP]
C34  CAPACITOR_0603_10V_1UF  [0603-CAP]
C36  CAPACITOR_0603_16V_0.47UF  [0603-CAP]
C55  CAPACITOR_0603_25V_1UF  [0603-CAP]
C56  CAPACITOR_0603_10V_68NF  [0603-CAP]
C57  CAPACITOR_0603_10V_68NF  [0603-CAP]
C61  CAPACITOR_0603_10V_0.1UF  [0603-CAP]
C62  CAPACITOR_0603_16V_0.47UF  [0603-CAP]
C63  CAPACITOR_0603_10V_1UF  [0603-CAP]
C64  CAPACITOR_0603_10V_1UF  [0603-CAP]
C65  CAPACITOR_0603_16V_0.47UF  [0603-CAP]
CUR_SHUNT  TEST_POINT  [5015]
R22  RESISTOR_0603_10.5K  [0603-RES]
R23  RESISTOR_0603_10.5K  [0603-RES]
R41  RESISTOR_0603_DNP  [0603-RES]
R42  RESISTOR_0603_2.74K  [0603-RES]
R43  RESISTOR_0603_100K  [0603-RES]
R44  RESISTOR_0603_2.74K  [0603-RES]
R75  RESISTOR_0603_10K  [0603-RES]
R76  RESISTOR_0603_12K  [0603-RES]
R77  RESISTOR_0603_10K  [0603-RES]
R78  RESISTOR_0603_12K  [0603-RES]
R106  RESISTOR_0603_10K  [0603-RES]
R107  RESISTOR_0603_10K  [0603-RES]
R108  RESISTOR_0603_10K  [0603-RES]
R109  RESISTOR_0603_10K  [0603-RES]
R110  RESISTOR_0603_5.1K  [0603-RES]
R111  RESISTOR_0603_4.12K  [0603-RES]
R122  RESISTOR_0603_12K  [0603-RES]
R123  RESISTOR_0603_7.5K  [0603-RES]
R124  RESISTOR_0603_7.5K  [0603-RES]
R125  RESISTOR_0603_12K  [0603-RES]
R126  RESISTOR_0603_12K  [0603-RES]
R127  RESISTOR_0603_20K  [0603-RES]
R128  RESISTOR_0603_12K  [0603-RES]
R129  RESISTOR_0603_7.5K  [0603-RES]
R130  RESISTOR_0603_7.5K  [0603-RES]
R131  RESISTOR_0603_12K  [0603-RES]
R132  RESISTOR_0603_12K  [0603-RES]
R133  RESISTOR_0603_20K  [0603-RES]
U4  OPAMP_1_CHANNEL_OPA991  [SC-70-5]
U5  OPAMP_1_CHANNEL_OPA991  [SC-70-5]
U16  OPAMP_1_CHANNEL_OPA991  [SC-70-5]
U17  OPAMP_2_CHANNEL_OPA_2991  [SOT-23-8]
U18  OPAMP_1_CHANNEL_OPA991  [SC-70-5]
U19  OPAMP_2_CHANNEL_OPA_2991  [SOT-23-8]
U33  OPAMP_1_CHANNEL_OPA991  [SC-70-5]

### Nets
+3V3: C29.1 C30.1 C33.1 C61.1 R108.2 U16.5(P:VDD) U17.8(P:VDD) U18.5(P:VDD) U19.8(P:VDD) ; also sheet 1,5
+12V: C55.1 U33.5(P:VDD) ; also sheet 1
+24V: C8.1 C16.1 U4.5(P:VDD) U5.5(P:VDD) ; also sheet 1,2,5
BSPD_CURRENT: BSPD_CURRENT.1 R23.2 U5.4(A:VOUT) ; also sheet 1,5
BSPD_CURRENT_REF: R22.2 U4.4(A:VOUT) ; also sheet 1
CURR_N: R106.1 ; also sheet 1
CURR_P: R107.1 ; also sheet 1
CURRENT: R43.2 U5.1(A:VIN+) ; also sheet 1
CURRENT_REF: R41.2 U4.1(A:VIN+) ; also sheet 1
CURRENT_SHUNT_OUT: C56.1 CUR_SHUNT.1 R110.1 R111.2 ; also sheet 5
GND: C8.2 C16.2 C29.2 C30.2 C31.2 C33.2 C36.2 C55.2 C56.2 C61.2 C62.2 C65.2 R41.1 R42.1 R43.1 R44.1 R76.2 R78.2 R110.2 R126.1 R127.1 R132.1 R133.1 U4.2(P:GND) U5.2(P:GND) U16.2(P:GND) U17.4(P:GND) U18.2(P:GND) U19.4(P:GND) U33.2(P:GND) ; also sheet 1,2,3,5
N$12: R23.1 R44.2 U5.3(A:VIN-)
N$26: C34.2 R124.1 R125.2
N$33: R22.1 R42.2 U4.3(A:VIN-)
N$45: C36.1 R124.2 U17.5(B:VIN+)
N$48: R77.2 R78.1 U18.1(A:VIN+)
N$50: C32.2 R122.2 R123.1
N$56: C32.1 R125.1 R126.2 U17.1(A:VOUT) U17.2(A:VIN-)
N$57: C31.1 R123.2 U17.3(A:VIN+)
N$58: R75.2 R76.1 U16.1(A:VIN+)
N$63: R107.2 R108.1 U33.1(A:VIN+)
N$64: C57.2 R106.2 R109.1 U33.3(A:VIN-)
N$67: C57.1 R109.2 R111.1 U33.4(A:VOUT)
N$70: C64.2 R130.1 R131.2
N$71: C65.1 R130.2 U19.5(B:VIN+)
N$72: C63.2 R128.2 R129.1
N$73: C63.1 R131.1 R132.2 U19.1(A:VOUT) U19.2(A:VIN-)
N$74: C62.1 R129.2 U19.3(A:VIN+)
PACK+_BUFFER: R128.1 U16.3(A:VIN-) U16.4(A:VOUT)
PACK+_FILTERED: C64.1 R133.2 U19.6(B:VIN-) U19.7(B:VOUT) ; also sheet 5
PACK+_OUT: R75.1 ; also sheet 3
TS+_OUT: R77.1 ; also sheet 3
TS+_OUT_BUFFER: R122.1 U18.3(A:VIN-) U18.4(A:VOUT)
TS+_OUT_FILTERED: C34.1 R127.2 U17.6(B:VIN-) U17.7(B:VOUT) ; also sheet 5

### Notes on the sheet
- Analog Filtering
- SSA-250 Current Sensor
- 5V to 24.16V
- 5V to 24.16V
- Josh Kirshenbaum

## Sheet 5 of 6: Teensy, LTC6820, CAN, Watchdog
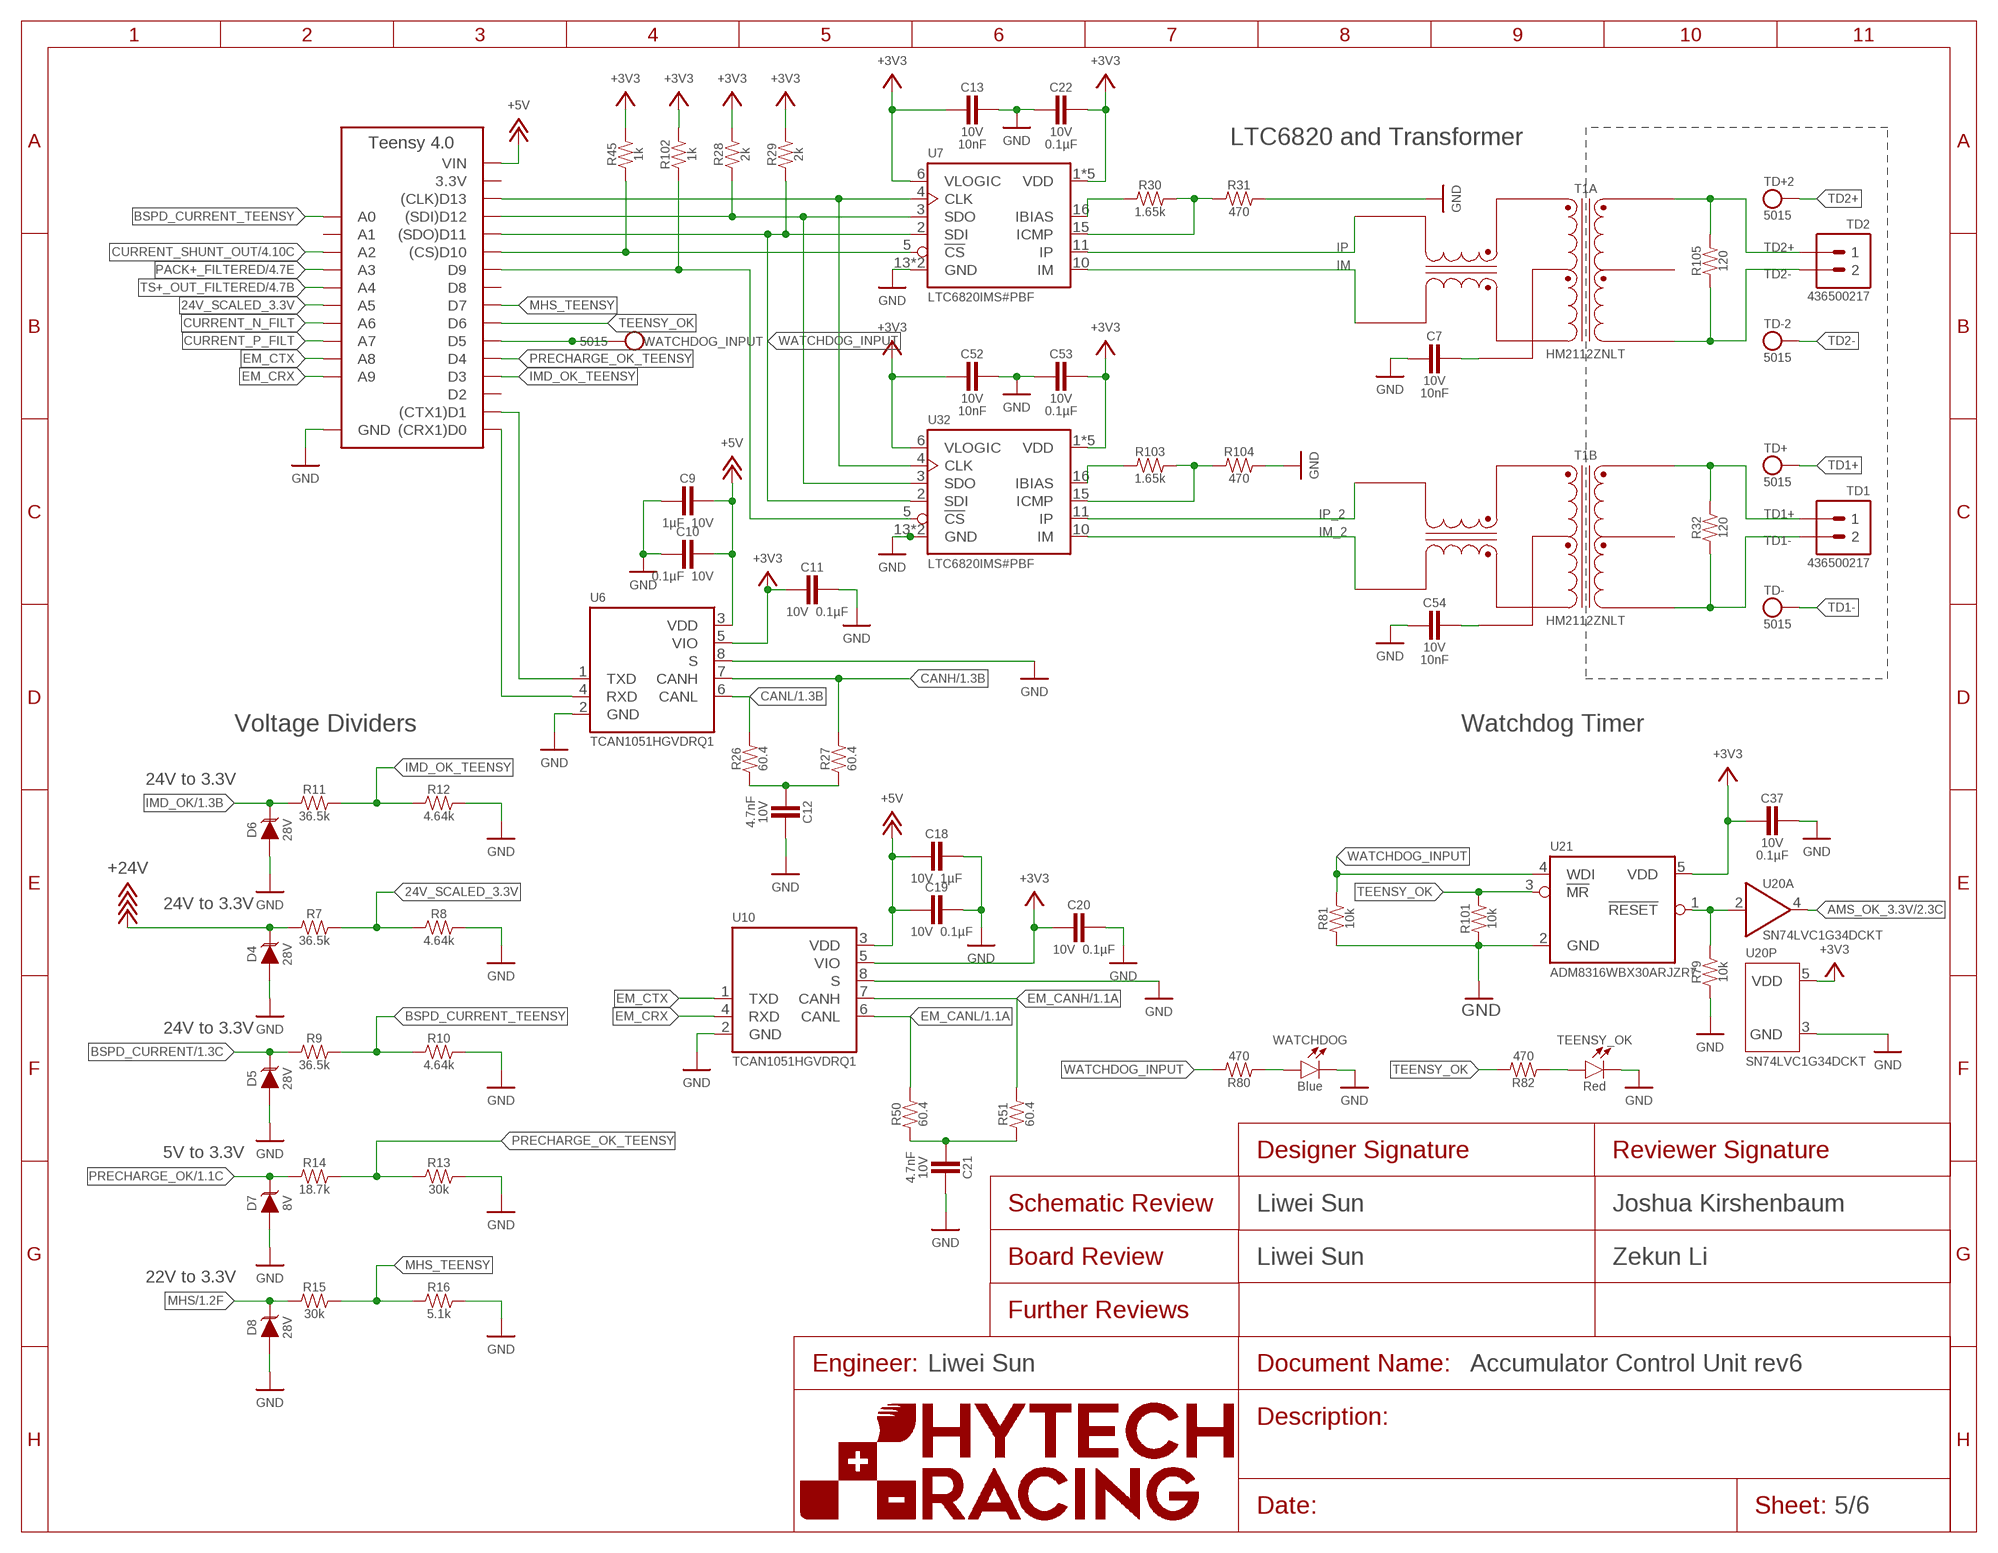
[diagram p4: schematic, sheet 5]
FRAME3 (FRAME): DESIGNER_BOARD: Liwei Sun; DESIGNER_SCHEMATIC: Liwei Sun; ENGINEER: Liwei Sun; REVIEWER_BOARD: Zekun Li; REVIEWER_SCHEMATIC: Joshua Kirshenbaum

### Parts
A3  TEENSY_4.0TH  [TEENSY_SHORT]
C7  CAPACITOR_0603_10V_10NF  [0603-CAP]
C9  CAPACITOR_0603_10V_1UF  [0603-CAP]
C10  CAPACITOR_0603_10V_0.1UF  [0603-CAP]
C11  CAPACITOR_0603_10V_0.1UF  [0603-CAP]
C12  CAPACITOR_0603_10V_4.7NF  [0603-CAP]
C13  CAPACITOR_0603_10V_10NF  [0603-CAP]
C18  CAPACITOR_0603_10V_1UF  [0603-CAP]
C19  CAPACITOR_0603_10V_0.1UF  [0603-CAP]
C20  CAPACITOR_0603_10V_0.1UF  [0603-CAP]
C21  CAPACITOR_0603_10V_4.7NF  [0603-CAP]
C22  CAPACITOR_0603_10V_0.1UF  [0603-CAP]
C37  CAPACITOR_0603_10V_0.1UF  [0603-CAP]
C52  CAPACITOR_0603_10V_10NF  [0603-CAP]
C53  CAPACITOR_0603_10V_0.1UF  [0603-CAP]
C54  CAPACITOR_0603_10V_10NF  [0603-CAP]
D4  TVS_DO-214AA_28V  [DO-214AA]
D5  TVS_DO-214AA_28V  [DO-214AA]
D6  TVS_DO-214AA_28V  [DO-214AA]
D7  TVS__8V  [SOT-23]
D8  TVS_DO-214AA_28V  [DO-214AA]
R7  RESISTOR_0603_36.5K  [0603-RES]
R8  RESISTOR_0603_4.64K  [0603-RES]
R9  RESISTOR_0603_36.5K  [0603-RES]
R10  RESISTOR_0603_4.64K  [0603-RES]
R11  RESISTOR_0603_36.5K  [0603-RES]
R12  RESISTOR_0603_4.64K  [0603-RES]
R13  RESISTOR_0603_  RESISTOR_0603_30K  [0603-RES]
R14  RESISTOR_0603_18.7K  [0603-RES]
R15  RESISTOR_0603_  RESISTOR_0603_30K  [0603-RES]
R16  RESISTOR_0603_5.1K  [0603-RES]
R26  RESISTOR_0603_60.4  [0603-RES]
R27  RESISTOR_0603_60.4  [0603-RES]
R28  RESISTOR_0603_2K  [0603-RES]
R29  RESISTOR_0603_2K  [0603-RES]
R30  RESISTOR_0603_1.65K  [0603-RES]
R31  RESISTOR_0603_470  [0603-RES]
R32  RESISTOR_0603_120  [0603-RES]
R45  RESISTOR_0603_1K  [0603-RES]
R50  RESISTOR_0603_60.4  [0603-RES]
R51  RESISTOR_0603_60.4  [0603-RES]
R79  RESISTOR_0603_10K  [0603-RES]
R80  RESISTOR_0603_470  [0603-RES]
R81  RESISTOR_0603_10K  [0603-RES]
R82  RESISTOR_0603_470  [0603-RES]
R101  RESISTOR_0603_10K  [0603-RES]
R102  RESISTOR_0603_1K  [0603-RES]
R103  RESISTOR_0603_1.65K  [0603-RES]
R104  RESISTOR_0603_470  [0603-RES]
R105  RESISTOR_0603_120  [0603-RES]
T1  TRANSFORMER_HM2112ZNLT_AIRGAP  [HM2112ZNLT_AIRGAP]
TD1  CONNECTOR-2_MF_T_V_  [MOLEX_MICROFIT_PTH_VERTICAL_02_SINGLE]
TD2  CONNECTOR-2_MF_T_V_  [MOLEX_MICROFIT_PTH_VERTICAL_02_SINGLE]
TD+  TEST_POINT  [MICRO_MINIATURE]
TD+2  TEST_POINT  [MICRO_MINIATURE]
TD-  TEST_POINT  [MICRO_MINIATURE]
TD-2  TEST_POINT  [MICRO_MINIATURE]
TEENSY_OK  LED_0603_RED  [0603-LED]
U6  TCAN1051HQV-Q1  [SOIC-08(NARROW,0.15")]
U7  LTC6820  [MSOP-16]
U10  TCAN1051HQV-Q1  [SOIC-08(NARROW,0.15")]
U20  LOGICGATE_BUFFER  [SC-70-5]
U21  ADM8316WBX30  [SOT-23-5]
U32  LTC6820  [MSOP-16]
WATCHDOG  LED_0603_BLUE  [0603-LED]
WATCHDOG_INPUT  TEST_POINT  [MICRO_MINIATURE]

### Nets
24V_SCALED_3.3V: A3.D19(A5) R7.2 R8.1
+3V3: C11.2 C13.2 C20.2 C22.1 C37.2 C52.2 C53.1 R28.2 R29.2 R45.2 R102.2 U6.5(VIO) U7.1(VDD) U7.6(VLOGIC) U7.7(VDD) U7.8(VDD) U7.9(VDD) U7.12(VDD) U10.5(VIO) U20.5(P:VDD) U21.5(VDD) U32.1(VDD) U32.6(VLOGIC) U32.7(VDD) U32.8(VDD) U32.9(VDD) U32.12(VDD) ; also sheet 1,4
+5V: A3.VIN C9.2 C10.2 C18.2 C19.2 U6.3(VDD) U10.3(VDD) ; also sheet 1,3
+24V: D4.2(C) R7.1 ; also sheet 1,2,4
AMS_OK_3.3V: U20.4(A:OUT) ; also sheet 2
BSPD_CURRENT: D5.2(C) R9.1 ; also sheet 1,4
BSPD_CURRENT_TEENSY: A3.D14(A0) R9.2 R10.1
CANH: R27.2 U6.7(CANH) ; also sheet 1
CANL: R26.2 U6.6(CANL) ; also sheet 1
CS_LTC_6820: A3.D10((CS)D10) R45.1 U7.5(!CS)
CURRENT_N_FILT: A3.D20(A6)
CURRENT_P_FILT: A3.D21(A7)
CURRENT_SHUNT_OUT: A3.D16(A2) ; also sheet 4
EM_CANH: R51.2 U10.7(CANH) ; also sheet 1
EM_CANL: R50.2 U10.6(CANL) ; also sheet 1
EM_CRX: A3.D23(A9) U10.4(RXD)
EM_CTX: A3.D22(A8) U10.1(TXD)
GND: A3.AGND/GND(GND) A3.GND C7.2 C9.1 C10.1 C11.1 C12.1 C13.1 C18.1 C19.1 C20.1 C21.1 C22.2 C37.1 C52.1 C53.2 C54.2 D4.1(A) D5.1(A) D6.1(A) D7.1(A) D8.1(A) R8.2 R10.2 R12.2 R13.2 R16.2 R31.2 R79.1 R81.1 R101.1 R104.2 TEENSY_OK.1(C) U6.2(GND) U6.8(S) U7.13(GND) U7.14(GND) U10.2(GND) U10.8(S) U20.3(P:GND) U21.2(GND) U32.13(GND) U32.14(GND) WATCHDOG.1(C) ; also sheet 1,2,3,4
IM: T1.10(A:TD-) U7.10(IM)
IM_2: T1.7(B:TD-) U32.10(IM)
IMD_OK: D6.2(C) R11.1 ; also sheet 1,2
IMD_OK_TEENSY: A3.D3 R11.2 R12.1
IP: T1.12(A:TD+) U7.11(IP)
IP_2: T1.9(B:TD+) U32.11(IP)
MHS: D8.2(C) R15.1 ; also sheet 1
MHS_TEENSY: A3.D7 R15.2 R16.1
N$13: A3.D11((SDO)D11) R29.1 U7.2(SDI) U32.2(SDI)
N$15: R79.2 U20.2(A:IN) U21.1(!RESET!)
N$21: C12.2 R26.1 R27.1
N$25: A3.D0((CRX1)D0) U6.4(RXD)
N$29: A3.D1((CTX1)D1) U6.1(TXD)
N$34: C21.2 R50.1 R51.1
N$36: R30.1 U7.16(IBIAS)
N$37: R30.2 R31.1 U7.15(ICMP)
N$38: R103.1 U32.16(IBIAS)
N$39: C7.1 T1.11(A:TCT)
N$40: A3.D9 R102.1 U32.5(!CS)
N$42: R103.2 R104.1 U32.15(ICMP)
N$43: A3.D12((SDI)D12) R28.1 U7.3(SDO) U32.3(SDO)
N$44: A3.D13((CLK)D13) U7.4(CLK) U32.4(CLK)
N$47: R80.1 WATCHDOG.2(A)
N$59: R82.1 TEENSY_OK.2(A)
N$62: C54.1 T1.8(B:TCT)
PACK+_FILTERED: A3.D17(A3) ; also sheet 4
PRECHARGE_OK: D7.3(C) R14.1 ; also sheet 1,3
PRECHARGE_OK_TEENSY: A3.D4 R13.1 R14.2
TD1+: R32.2 T1.4(B:MX+) TD1.1 TD+.1
TD1-: R32.1 T1.6(B:MX-) TD1.2 TD-.1
TD2+: R105.2 T1.1(A:MX+) TD2.1 TD+2.1
TD2-: R105.1 T1.3(A:MX-) TD2.2 TD-2.1
TEENSY_OK: A3.D6 R82.2 R101.2 U21.3(!MR!)
TS+_OUT_FILTERED: A3.D18(A4) ; also sheet 4
WATCHDOG_INPUT: A3.D5 R80.2 R81.2 U21.4(WDI) WATCHDOG_INPUT.1
Unconnected: A3.D2 A3.D8 A3.D15(A1) T1.2(A:MCT) T1.5(B:MCT)

### Notes on the sheet
- LTC6820 and Transformer
- Voltage Dividers | Watchdog Timer
- 24V to 3.3V
- 24V to 3.3V
- 24V to 3.3V
- 5V to 3.3V
- 22V to 3.3V

## Sheet 6 of 6: Ordering Components
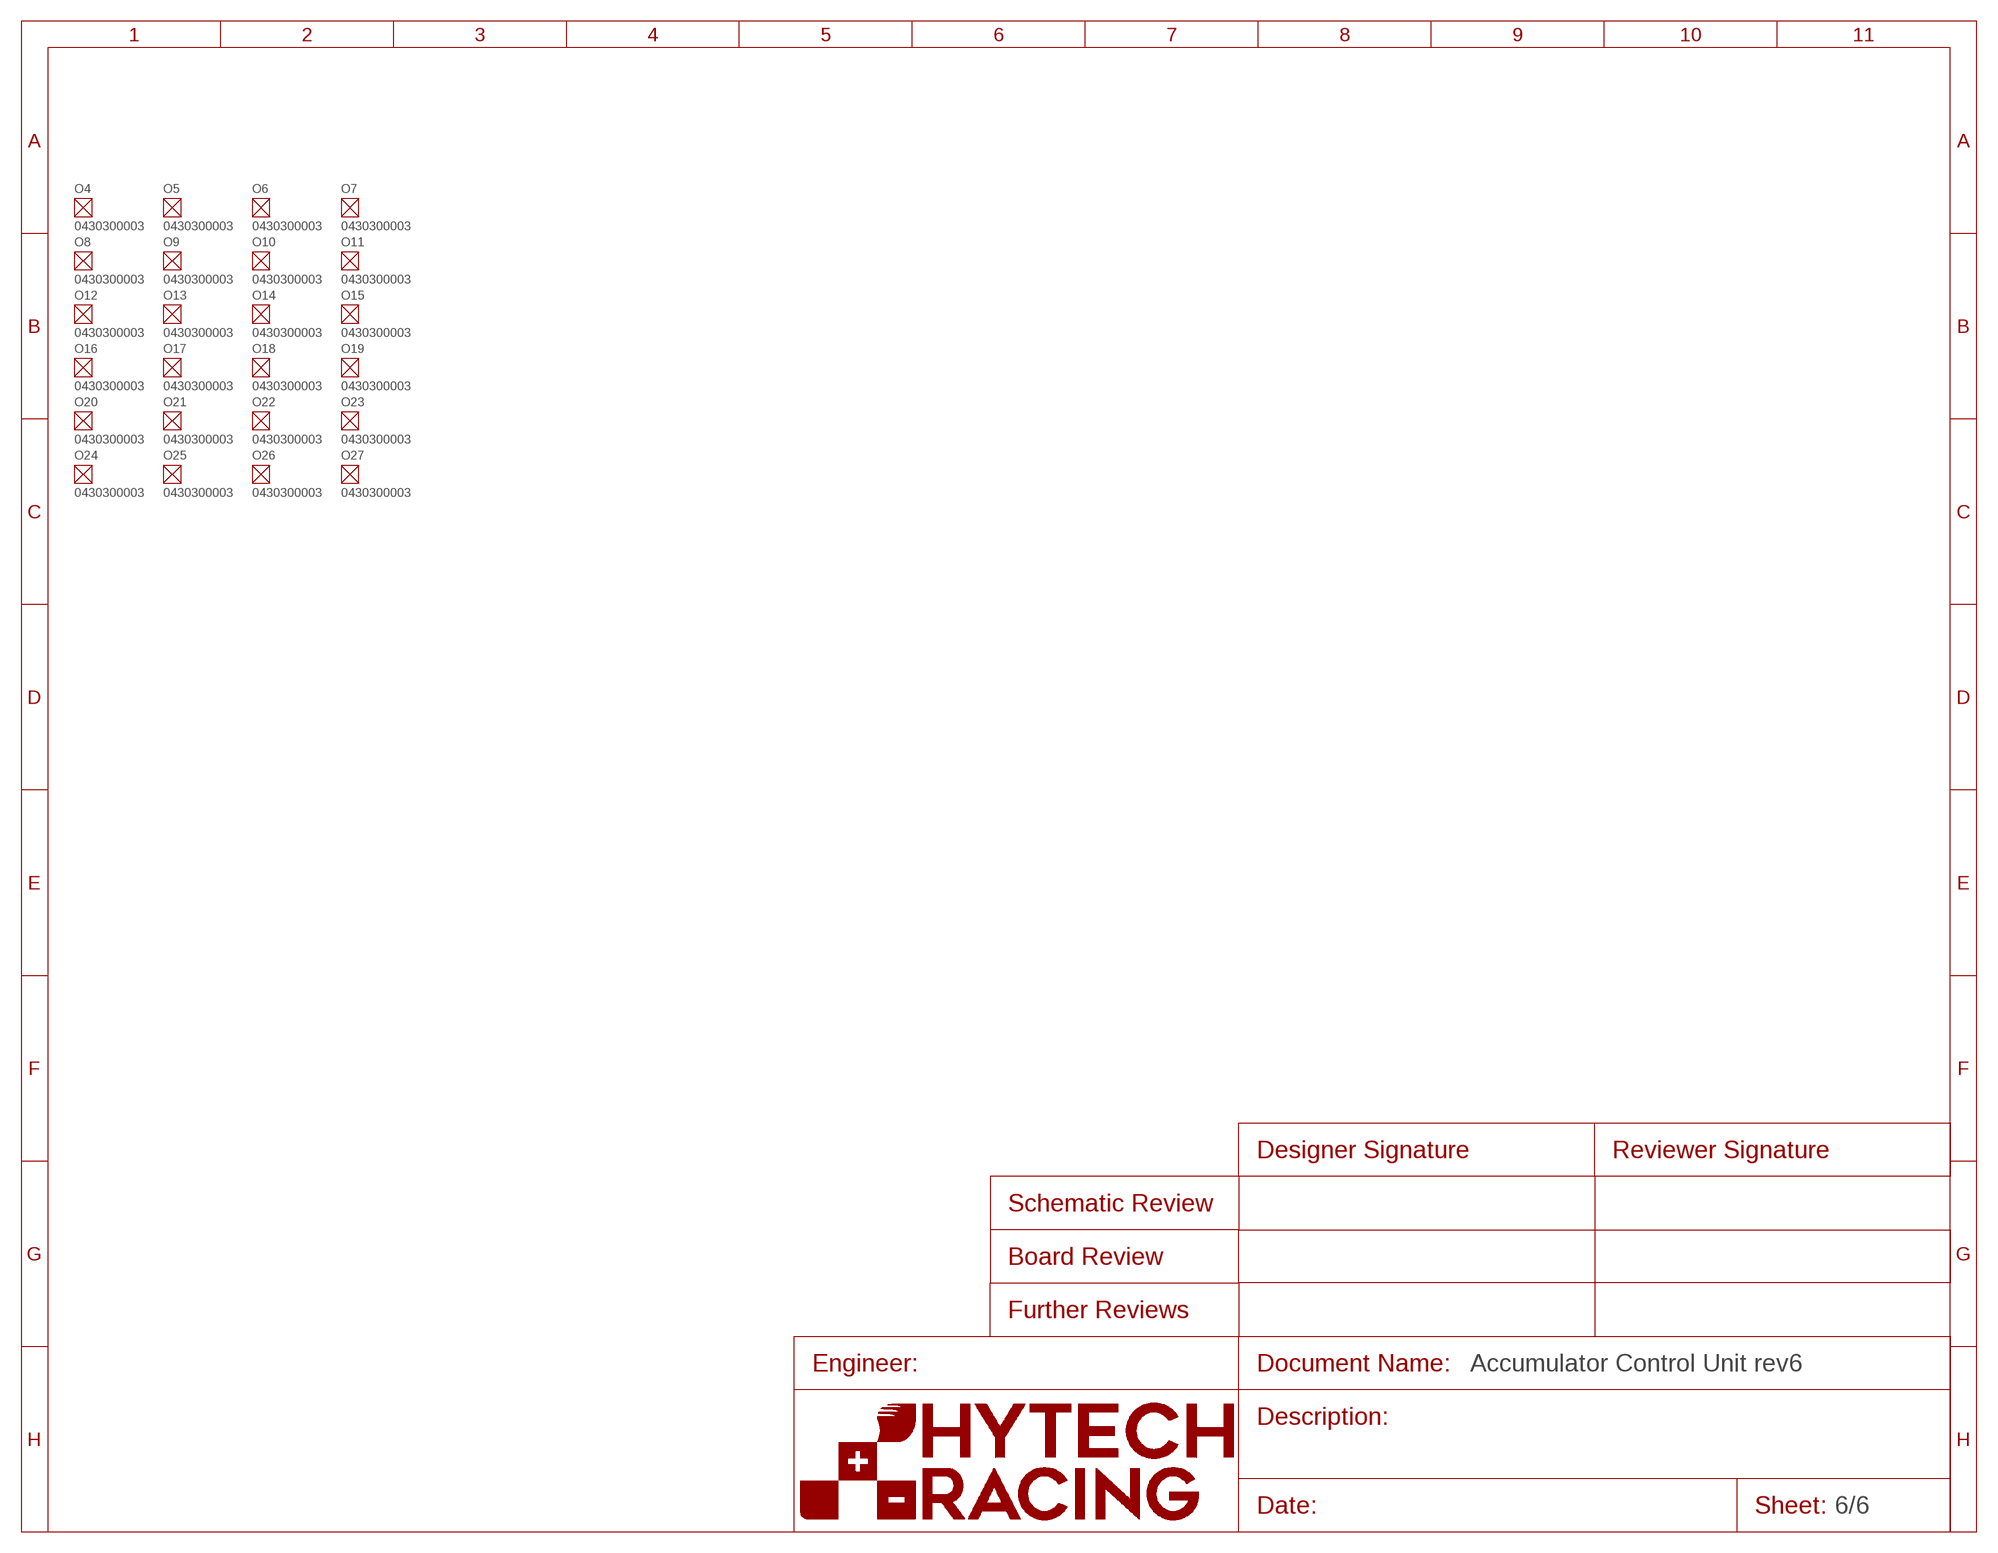
[diagram p5: schematic, sheet 6]
O4 (CRIMP_MICROFIT_20-24): DKPN: WM2776CT-ND; GAUGE: 20-24; MANUFACTURER: Molex; MOPN: 538-43030-0003; MPN: 0430300003
O5 (CRIMP_MICROFIT_20-24): DKPN: WM2776CT-ND; GAUGE: 20-24; MANUFACTURER: Molex; MOPN: 538-43030-0003; MPN: 0430300003
O6 (CRIMP_MICROFIT_20-24): DKPN: WM2776CT-ND; GAUGE: 20-24; MANUFACTURER: Molex; MOPN: 538-43030-0003; MPN: 0430300003
O7 (CRIMP_MICROFIT_20-24): DKPN: WM2776CT-ND; GAUGE: 20-24; MANUFACTURER: Molex; MOPN: 538-43030-0003; MPN: 0430300003
O8 (CRIMP_MICROFIT_20-24): DKPN: WM2776CT-ND; GAUGE: 20-24; MANUFACTURER: Molex; MOPN: 538-43030-0003; MPN: 0430300003
O9 (CRIMP_MICROFIT_20-24): DKPN: WM2776CT-ND; GAUGE: 20-24; MANUFACTURER: Molex; MOPN: 538-43030-0003; MPN: 0430300003
O10 (CRIMP_MICROFIT_20-24): DKPN: WM2776CT-ND; GAUGE: 20-24; MANUFACTURER: Molex; MOPN: 538-43030-0003; MPN: 0430300003
O11 (CRIMP_MICROFIT_20-24): DKPN: WM2776CT-ND; GAUGE: 20-24; MANUFACTURER: Molex; MOPN: 538-43030-0003; MPN: 0430300003
O12 (CRIMP_MICROFIT_20-24): DKPN: WM2776CT-ND; GAUGE: 20-24; MANUFACTURER: Molex; MOPN: 538-43030-0003; MPN: 0430300003
O13 (CRIMP_MICROFIT_20-24): DKPN: WM2776CT-ND; GAUGE: 20-24; MANUFACTURER: Molex; MOPN: 538-43030-0003; MPN: 0430300003
O14 (CRIMP_MICROFIT_20-24): DKPN: WM2776CT-ND; GAUGE: 20-24; MANUFACTURER: Molex; MOPN: 538-43030-0003; MPN: 0430300003
O15 (CRIMP_MICROFIT_20-24): DKPN: WM2776CT-ND; GAUGE: 20-24; MANUFACTURER: Molex; MOPN: 538-43030-0003; MPN: 0430300003
O16 (CRIMP_MICROFIT_20-24): DKPN: WM2776CT-ND; GAUGE: 20-24; MANUFACTURER: Molex; MOPN: 538-43030-0003; MPN: 0430300003
O17 (CRIMP_MICROFIT_20-24): DKPN: WM2776CT-ND; GAUGE: 20-24; MANUFACTURER: Molex; MOPN: 538-43030-0003; MPN: 0430300003
O18 (CRIMP_MICROFIT_20-24): DKPN: WM2776CT-ND; GAUGE: 20-24; MANUFACTURER: Molex; MOPN: 538-43030-0003; MPN: 0430300003
O19 (CRIMP_MICROFIT_20-24): DKPN: WM2776CT-ND; GAUGE: 20-24; MANUFACTURER: Molex; MOPN: 538-43030-0003; MPN: 0430300003
O20 (CRIMP_MICROFIT_20-24): DKPN: WM2776CT-ND; GAUGE: 20-24; MANUFACTURER: Molex; MOPN: 538-43030-0003; MPN: 0430300003
O21 (CRIMP_MICROFIT_20-24): DKPN: WM2776CT-ND; GAUGE: 20-24; MANUFACTURER: Molex; MOPN: 538-43030-0003; MPN: 0430300003
O22 (CRIMP_MICROFIT_20-24): DKPN: WM2776CT-ND; GAUGE: 20-24; MANUFACTURER: Molex; MOPN: 538-43030-0003; MPN: 0430300003
O23 (CRIMP_MICROFIT_20-24): DKPN: WM2776CT-ND; GAUGE: 20-24; MANUFACTURER: Molex; MOPN: 538-43030-0003; MPN: 0430300003
O24 (CRIMP_MICROFIT_20-24): DKPN: WM2776CT-ND; GAUGE: 20-24; MANUFACTURER: Molex; MOPN: 538-43030-0003; MPN: 0430300003
O25 (CRIMP_MICROFIT_20-24): DKPN: WM2776CT-ND; GAUGE: 20-24; MANUFACTURER: Molex; MOPN: 538-43030-0003; MPN: 0430300003
O26 (CRIMP_MICROFIT_20-24): DKPN: WM2776CT-ND; GAUGE: 20-24; MANUFACTURER: Molex; MOPN: 538-43030-0003; MPN: 0430300003
O27 (CRIMP_MICROFIT_20-24): DKPN: WM2776CT-ND; GAUGE: 20-24; MANUFACTURER: Molex; MOPN: 538-43030-0003; MPN: 0430300003

## Power pins joined to a net without a drawn wire
3.3V: A3.3.3V

## Library data of the parts
3.3V AMS_OK = HyTechDevices - Copy:LED_?_*: LED; COLOR: Green; DKPN: 754-1790-1-ND; MANUFACTURER: Kingbright; MOPN: 604-APT1608ZGCK; MPN: APT1608ZGCK
5V = HyTechDevices - Copy:LED_?_*: LED; COLOR: Blue; DKPN: 754-1789-1-ND; MANUFACTURER: Kingbright; MOPN: 604-APT1608VBC/D; MPN: APT1608VBC/D
12V = HyTechDevices - Copy:LED_?_*: LED; COLOR: Red; DKPN: 754-1786-1-ND; MANUFACTURER: Kingbright; MOPN: 604-APT1608SECKJ3PRV; MPN: APT1608SECK/J3-PRV
24V = HyTechDevices:LED_?_*: LED; COLOR: Orange; DKPN: 754-1120-1-ND; MANUFACTURER: Kingbright; MOPN: 604-APT1608SECK; MPN: APT1608SECK
A1 = HyTechDevices:VOLTAGE_REGULATOR_MODULE_?_*: Voltage Regulator Modules OKI-78SR Datasheet <https://www.mouser.com/datasheet/2/281/oki-78sr-56393.pdf>; DKPN: 811-3293-ND; MANUFACTURER: Murata Power Solutions Inc.; MOPN: 580-OKI78SR12/1W36C; MPN: OKI-78SR-12/1.0-W36-C
A2 = HyTechDevices:VOLTAGE_REGULATOR_MODULE_?_*: Voltage Regulator Modules OKI-78SR Datasheet <https://www.mouser.com/datasheet/2/281/oki-78sr-56393.pdf>; DKPN: 811-2196-5-ND; MANUFACTURER: Murata Power Solutions Inc.; MOPN: 580-OKI78SR5/1.5W36C; MPN: OKI-78SR-5/1.5-W36-C
A3 = HyTechDevices:TEENSY_4.0: Teensy 4.0 Datasheet <https://www.pjrc.com/store/teensy40.html> Requires ordering of: 2: 14 pin, 0.1" pitch female headers. Recommend Samtec SSM-114-L-SV for surface mount variant.; TEENSY: 4.0
BSPD_CURRENT CURRENT_REF CURRENT_SENSE PACK+_OUT_TEST PC_OK TD+ TD+2 TD- TD-2 TP_AMS_OK TP_IMD_OK TS+_OUT_TEST WATCHDOG_INPUT = HyTechDevices - Copy:TEST_POINT: Test Point; DKPN: 36-5015CT-ND; MANUFACTURER: Keystone Electronics; MOPN: 534-5015; MPN: 5015
C1-C3 = HyTechDevices:CAPACITOR_?_*: Capacitor, Non-Polarized; CAPACITANCE: 10uF; DKPN: 490-18663-2-ND; MANUFACTURER: Murata; MOPN: 81-GRM21BR61H106KE3L; MPN: GRM21BR61H106KE43L; TOLERANCE: 10%; VOLTAGE: 50V
C4 = HyTechDevices:CAPACITOR_?_*: Capacitor, Non-Polarized; CAPACITANCE: 10µF; DKPN: 490-7202-1-ND; MANUFACTURER: Murata Electronics; MOPN: 81-GRM188R61E106MA3D; MPN: GRM188R61E106MA73D; TOLERANCE: 20%; VOLTAGE: 25V
C5 C28 = HyTechDevices - Copy:CAPACITOR_?_*: Capacitor, Non-Polarized; CAPACITANCE: 4.7µF; DKPN: 1276-1044-1-ND; MANUFACTURER: Samsung Electro-Mechanics; MOPN: 187-CL10A475KP8NNNC; MPN: CL10A475KP8NNNC; TOLERANCE: 10%; VOLTAGE: 10V
C6 = HyTechDevices - Copy:CAPACITOR_?_*: Capacitor, Non-Polarized; CAPACITANCE: 1µF; DKPN: 311-1796-1-ND; MANUFACTURER: Yageo; MOPN: 603-CC603KRX7R6BB105; MPN: CC0603KRX7R6BB105; TOLERANCE: 10%; VOLTAGE: 10V
C7 C17 C54 = HyTechDevices - Copy:CAPACITOR_?_*: Capacitor, Non-Polarized; CAPACITANCE: 10nF; DKPN: 311-4054-1-ND; MANUFACTURER: Yageo; MOPN: 603-CC603KRX7R6BB103; MPN: CC0603KRX7R6BB103; TOLERANCE: 10%; VOLTAGE: 10V
C8 C16 = HyTechDevices:CAPACITOR_?_*: Capacitor, Non-Polarized; CAPACITANCE: 0.1µF; DKPN: 311-1344-1-ND; MANUFACTURER: Yageo; MOPN: 603-CC603KRX7R9BB104; MPN: CC0603KRX7R9BB104; TOLERANCE: 10%; VOLTAGE: 50V
C9 C18 C32 C34 C63 C64 = HyTechDevices:CAPACITOR_?_*: Capacitor, Non-Polarized; CAPACITANCE: 1µF; DKPN: 311-1796-1-ND; MANUFACTURER: Yageo; MOPN: 603-CC603KRX7R6BB105; MPN: CC0603KRX7R6BB105; TOLERANCE: 10%; VOLTAGE: 10V
C10 C11 C14 C15 C19 C20 C22-C25 C37-C42 C53 = HyTechDevices:CAPACITOR_?_*: Capacitor, Non-Polarized; CAPACITANCE: 0.1µF; DKPN: 720-1688-1-ND; MANUFACTURER: Vishay Vitramon; MOPN: 77-VJ0603Y104JXQPBC; MPN: VJ0603Y104JXQPW1BC; TOLERANCE: 5%; VOLTAGE: 10V
C12 C21 = HyTechDevices:CAPACITOR_?_*: Capacitor, Non-Polarized; CAPACITANCE: 4.7nF; DKPN: 732-7931-1-ND; MANUFACTURER: Würth Elektronik; MOPN: 710-885012206012; MPN: 885012206012; TOLERANCE: 10%; VOLTAGE: 10V
C13 C52 = HyTechDevices:CAPACITOR_?_*: Capacitor, Non-Polarized; CAPACITANCE: 10nF; DKPN: 311-4054-1-ND; MANUFACTURER: Yageo; MOPN: 603-CC603KRX7R6BB103; MPN: CC0603KRX7R6BB103; TOLERANCE: 10%; VOLTAGE: 10V
C26 = HyTechDevices - Copy:CAPACITOR_?_*: Capacitor, Non-Polarized; CAPACITANCE: 0.1µF; DKPN: 1276-1006-1-ND; MANUFACTURER: Samsung Electro-Mechanics; MOPN: 187-CL10B104KA8NNNC; MPN: CL10B104KA8NNNC; TOLERANCE: 10%; VOLTAGE: 25V
C27 = HyTechDevices - Copy:CAPACITOR_?_*: Capacitor, Non-Polarized; CAPACITANCE: 1µF; DKPN: 1276-1184-1-ND; MANUFACTURER: Samsung Electro-Mechanics; MOPN: 187-CL10B105KA8NNNC; MPN: CL10B105KA8NNNC; TOLERANCE: 10%; VOLTAGE: 25V
C29 = HyTechDevices:CAPACITOR_?_*: Capacitor, Non-Polarized; CAPACITANCE: 0.1µF; DKPN: 1276-1006-1-ND; MANUFACTURER: Samsung Electro-Mechanics; MOPN: 187-CL10B104KA8NNNC; MPN: CL10B104KA8NNNC; TOLERANCE: 10%; VOLTAGE: 25V
C30 C33 C61 = HyTechDevices - Copy:CAPACITOR_?_*: Capacitor, Non-Polarized; CAPACITANCE: 0.1µF; DKPN: 720-1688-1-ND; MANUFACTURER: Vishay Vitramon; MOPN: 77-VJ0603Y104JXQPBC; MPN: VJ0603Y104JXQPW1BC; TOLERANCE: 5%; VOLTAGE: 10V
C31 C36 C62 C65 = HyTechDevices:CAPACITOR_?_*: Capacitor, Non-Polarized; CAPACITANCE: 0.47µF; DKPN: 445-5192-1-ND; MANUFACTURER: TDK Corporation; MOPN: 810-C1608X7R1C474K; MPN: C1608X7R1C474K080AC; TOLERANCE: 10%; VOLTAGE: 16V
C43 C55 = HyTechDevices:CAPACITOR_?_*: Capacitor, Non-Polarized; CAPACITANCE: 1µF; DKPN: 1276-1184-1-ND; MANUFACTURER: Samsung Electro-Mechanics; MOPN: 187-CL10B105KA8NNNC; MPN: CL10B105KA8NNNC; TOLERANCE: 10%; VOLTAGE: 25V
C56 C57 = HyTechDevices:CAPACITOR_?_*: Capacitor, Non-Polarized; CAPACITANCE: 68nF; DKPN: 399-C0603C683K8RAC7867CT-ND; MANUFACTURER: KEMET; MOPN: 80-C0603C683K8R; MPN: C0603C683K8RACTU; TOLERANCE: 10%; VOLTAGE: 10V
CUR_SHUNT = HyTechDevices:TEST_POINT: Test Point for Probing; DKPN: 36-5015CT-ND; MANUFACTURER: Keystone Electronics; MOPN: 534-5015; MPN: 5015
CURRENT_SHUNT EM = HyTechDevices:CONNECTOR-4_?_*: 4 Pin Connector; DKPN: 2266-43045-0414-ND; MANUFACTURER: Molex; MOPN: 538-43045-0414; MPN: 430450414
D1 D3 D7 = HyTechDevices:TVS_?_*: TVS Diode GSOT Datasheet <https://www.mouser.com/datasheet/2/427/gsot03-1767593.pdf>; DKPN: GSOT08-E3-08TR-ND; MANUFACTURER: Vishay General Semiconductor - Diodes Division; MOPN: 78-GSOT08-E3-08; MPN: GSOT08-E3-08; VOLTAGE: 8V
D2 = HyTechDevices:TVS_?_*: TVS Diode GSOT Datasheet <https://www.mouser.com/datasheet/2/427/gsot03-1767593.pdf>; DKPN: 118-1.5SMBJ30ATR-ND; MANUFACTURER: Bourns Inc.; MOPN: 652-1.5SMBJ30A; MPN: 1.5SMBJ30A; VOLTAGE: 30V
D4-D6 D8 = HyTechDevices:TVS_?_*: TVS Diode GSOT Datasheet <https://www.mouser.com/datasheet/2/427/gsot03-1767593.pdf>; DKPN: 118-1.5SMBJ28ATR-ND; MANUFACTURER: Bourns Inc.; MOPN: 652-1.5SMBJ28A; MPN: 1.5SMBJ28A; VOLTAGE: 28V
D9 D10 = HyTechDevices:TVS_?_*: TVS Diode GSOT Datasheet <https://www.mouser.com/datasheet/2/427/gsot03-1767593.pdf>; DKPN: GSOT15-E3-08CT-ND; MANUFACTURER: Vishay General Semiconductor - Diodes Division; MOPN: 78-GSOT15-E3-08; MPN: GSOT15-E3-08; VOLTAGE: 15V
D11 = HyTechDevices:ZENER_?_*: Zener Diode 1SMB5949B-13 <https://www.diodes.com/assets/Datasheets/ds32125.pdf> SMBJ5350B-TP <https://www.mccsemi.com/pdf/Products/SMBJ5338B-SMBJ5388B(SMB).pdf>; CURRENT: 0.031A; DKPN: 1SMB5927B-13DICT-ND; MANUFACTURER: Diodes Incorporated; MOPN: 621-1SMB5927B-13; MPN: 1SMB5927B-13; VOLTAGE: 12V
F1 F2 = HyTechDevices:FUSE_?_*: Fuse 885 Series <https://www.mouser.com/datasheet/2/240/Littelfuse_Fuse_885_Datasheet_pdf-1371443.pdf> MST 250 Series <https://www.mouser.com/datasheet/2/358/typ_MST_250-1772502.pdf> OMF 125 Series <https://www.mouser.com/datasheet/2/358/typ_OMF_125-1275954.pdf> 0686F0750-01 <https://www.mouser.com/datasheet/2/643/ds-CP-c2f-series-1291054.pdf>; CURRENT: 0.75A; DKPN: 507-2159-2-ND; I2T: 0.0013; MANUFACTURER: Bel Fuse; MOPN: 530-0686F0750-01; MPN: 0686F0750-01; VOLTAGE: 63V
IMD = HyTechDevices:CONNECTOR-6_?_*: 6 Pin Connector; DKPN: WM1797-ND; MANUFACTURER: Molex; MOPN: 538-43045-0614; MPN: 430450614
IMD_OK = HyTechDevices - Copy:LED_?_*: LED; COLOR: Orange; DKPN: 754-1120-1-ND; MANUFACTURER: Kingbright; MOPN: 604-APT1608SECK; MPN: APT1608SECK
J1 = HyTechDevices:CONNECTOR-12_?_*: 12 pin connector Datasheet <https://www.mouser.com/datasheet/2/276/0430451214_PCB_HEADERS-143184.pdf>; DKPN: WM1800-ND; MANUFACTURER: MOLEX; MOPN: 538-43045-1214; MPN: 430451214
J2 = HyTechDevices:CONNECTOR-16_?_*: 16 pin connector Datasheet <https://www.molex.com/webdocs/datasheets/pdf/en-us/0430451614_PCB_HEADERS.pdf>; DKPN: WM4718-ND; MANUFACTURER: MOLEX; MOPN: 538-43045-1614; MPN: 0430451614
K1 U2 U3 = HyTechDevices:RELAY_SOLIDSTATE_NO_*: AQY214EHA Normally Open Solid State Relay Datasheet <https://www.datasheetq.com/datasheet-download/287654/1/Panasonic/AQY214EH> Crydom CMX Series Solid State Normally Open Relay Datasheet <https://www.mouser.com/datasheet/2/657/cmx_series_dc_pcb_mount-1370813.pdf> AB38S-Q Datasheet <https://comus-intl.com/wp-content/uploads/2016/09/AB38S-Q.pdf> CPC1020NTR Datasheet <https://www.mouser.com/datasheet/2/240/CPC1020N-1546163.pdf>; DKPN: 255-1436-5-ND; MANUFACTURER: Panasonic; MOPN: 769-AQY214EHA; MPN: AQY214EHA
OKHS = HyTechDevices - Copy:LED_?_*: LED; COLOR: Yellow; DKPN: 754-1788-1-ND; MANUFACTURER: Kingbright; MOPN: 604-APT1608SYCK/J3-PRV; MPN: APT1608SYCK/J3-PRV
PRECHARGE_OK TEENSY_OK TSAL_RED = HyTechDevices:LED_?_*: LED; COLOR: Red; DKPN: 754-1786-1-ND; MANUFACTURER: Kingbright; MOPN: 604-APT1608SECKJ3PRV; MPN: APT1608SECK/J3-PRV
Q1-Q4 = HyTechDevices:TRANSISTOR_N_MOS_?_*: N-MOSFET PMV15ENEA Datasheet <https://www.mouser.com/datasheet/2/916/PMV15ENEA-1604828.pdf> TK6P65W Datasheet <https://www.mouser.com/datasheet/2/408/TK6P65W_datasheet_en_20151225-1916290.pdf> SIR638ADP Datasheet <https://www.mouser.com/datasheet/2/427/sir638adp-1766131.pdf> DMG3406L Datasheet <https://www.diodes.com/assets/Datasheets/DMG3406L.pdf> STL2N80K5 <https://www.mouser.com/datasheet/2/389/dm00092662-1798082.pdf>; DKPN: 1727-8588-1-ND; MANUFACTURER: Nexperia USA Inc.; MOPN: 771-PMV15ENEAR; MPN: PMV15ENEAR
Q5 = HyTechDevices:TRANSISTOR_P_MOS_?_*: P-MOSFET SI2369DS Datasheet <https://www.mouser.com/datasheet/2/427/si2369d-1764360.pdf> DMP3056L Datasheet <https://www.mouser.com/datasheet/2/115/DIOD_S_A0012915142_1-2543925.pdf>; DKPN: DMP3056L-7DITR-ND; MANUFACTURER: Diodes Incorporated; MOPN: 621-DMP3056L-7; MPN: DMP3056L-7
R1 R6 R70 R71 = HyTechDevices:RESISTOR_?_*: Resistor; DKPN: 311-10.0HRCT-ND; MANUFACTURER: Yageo; MOPN: 603-RC0603FR-0710RL; MPN: RC0603FR-0710RL; POWER: 0.1W; RESISTANCE: 10; TOLERANCE: 1%; VOLTAGE_CONTINUOUS: 1.00V; VOLTAGE_MAX: 75V
R2 R5 R47 R69 R79 R81 R94 R101 R106-R109 = HyTechDevices:RESISTOR_?_*: Resistor; DKPN: P10KBDCT-ND; MANUFACTURER: Panasonic Electronic Components; MOPN: 667-ERA-3ARB103V; MPN: ERA-3ARB103V; POWER: 0.1W; RESISTANCE: 10k; TOLERANCE: 0.1%; VOLTAGE_CONTINUOUS: 31.62V; VOLTAGE_MAX: 75V
R3 R20 R127 R133 = HyTechDevices:RESISTOR_?_*: Resistor; DKPN: 311-20.0KHRTR-ND; MANUFACTURER: Yageo; MOPN: 603-RC0603FR-0720KL; MPN: RC0603FR-0720KL; POWER: 0.1 W; RESISTANCE: 20k; TOLERANCE: 1%; VOLTAGE_CONTINUOUS: 44.72V; VOLTAGE_MAX: 75V
R4 R16 R21 R110 = HyTechDevices:RESISTOR_?_*: Resistor; DKPN: 311-5.10KHRTR-ND; MANUFACTURER: Yageo; MOPN: 603-RC0603FR-075K1L; MPN: RC0603FR-075K1L; POWER: 0.1W; RESISTANCE: 5.1k; TOLERANCE: 1%; VOLTAGE_CONTINUOUS: 22.58V; VOLTAGE_MAX: 75V
R7 R9 R11 R58 = HyTechDevices:RESISTOR_?_*: Resistor; DKPN: 311-36.5KHRCT-ND; MANUFACTURER: Yageo; MOPN: 603-RC0603FR-0736K5L; MPN: RC0603FR-0736K5L; POWER: 0.1W; RESISTANCE: 36.5k; TOLERANCE: 1%; VOLTAGE_CONTINUOUS: 60.42V; VOLTAGE_MAX: 75V
R8 R10 R12 = HyTechDevices:RESISTOR_?_*: Resistor; DKPN: 311-4.64KHRCT-ND; MANUFACTURER: Yageo; MOPN: 603-RC0603FR-074K64L; MPN: RC0603FR-074K64L; POWER: 0.1W; RESISTANCE: 4.64k; TOLERANCE: 1%; VOLTAGE_CONTINUOUS: 21.54V; VOLTAGE_MAX: 75V
R13 R15 = HyTechDevices:RESISTOR_?_*: Resistor; DKPN: P30KBDCT-ND; MANUFACTURER: Panasonic Electronic Components; MOPN: 667-ERA-3ARB303V; MPN: ERA-3ARB303V; POWER: 0.1W; RESISTANCE: 30k; TOLERANCE: 0.1%; VOLTAGE_CONTINUOUS: 54.77V; VOLTAGE_MAX: 75V
R14 = HyTechDevices:RESISTOR_?_*: Resistor; DKPN: 311-18.7KHRCT-ND; MANUFACTURER: Yageo; MOPN: 603-RC0603FR-0718K7L; MPN: RC0603FR-0718K7L; POWER: 0.1W; RESISTANCE: 18.7k; TOLERANCE: 1%; VOLTAGE_CONTINUOUS: 43.24V; VOLTAGE_MAX: 75V
R17 R19 = HyTechDevices - Copy:RESISTOR_?_*: Resistor; DKPN: 13-RC0603DR-072K2LCT-ND; MANUFACTURER: Yageo; MOPN: 603-RC0603DR-072K2L; MPN: RC0603DR-072K2L; POWER: 0.1W; RESISTANCE: 2.2k; TOLERANCE: 0.5%; VOLTAGE_CONTINUOUS: 75V; VOLTAGE_MAX: 75V
R18 R25 R28 R29 R48 R72 R74 R95 = HyTechDevices:RESISTOR_?_*: Resistor; DKPN: 10-ERJ-UP3F2001VTR-ND; MANUFACTURER: Panasonic Electronic Components; MOPN: 667-ERJ-UP3F2001V; MPN: ERJ-UP3F2001V; POWER: 0.25W; RESISTANCE: 2k; TOLERANCE: 1%; VOLTAGE_CONTINUOUS: 22.36V; VOLTAGE_MAX: 150V
R22 R23 = HyTechDevices:RESISTOR_?_*: Resistor; DKPN: P10.5KDBCT-ND; MANUFACTURER: Panasonic Electronic Components; MOPN: 677-ERA-3AEB1052V; MPN: ERA-3AEB1052V; POWER: 0.1W; RESISTANCE: 10.5k; TOLERANCE: 0.1%; VOLTAGE_CONTINUOUS: 32.40V; VOLTAGE_MAX: 75V
R24 R45 R65 R73 R83 R89 R96 R97 R102 = HyTechDevices:RESISTOR_?_*: Resistor; DKPN: 1712-CPF-A-0603B1K0ETR-ND; MANUFACTURER: TE Connectivity Passive Product; MOPN: 279-CPF-A-0603B1K0E; MPN: CPF-A-0603B1K0E; POWER: 0.0625W; RESISTANCE: 1k; TOLERANCE: 0.1%; VOLTAGE_CONTINUOUS: 7.9V; VOLTAGE_MAX: 50V
R26 R27 R50 R51 = HyTechDevices:RESISTOR_?_*: Resistor; DKPN: 311-60.4HRCT-ND; MANUFACTURER: Yageo; MOPN: 603-RC0603FR-0760R4L; MPN: RC0603FR-0760R4L; POWER: 0.1W; RESISTANCE: 60.4; TOLERANCE: 1%; VOLTAGE_CONTINUOUS: 2.48V; VOLTAGE_MAX: 75V
R30 R103 = HyTechDevices:RESISTOR_?_*: Resistor; DKPN: 311-1.65KHRCT-ND; MANUFACTURER: Yageo; MOPN: 603-RC0603FR-071K65L; MPN: RC0603FR-071K65L; POWER: 0.1W; RESISTANCE: 1.65k; TOLERANCE: 1%; VOLTAGE_CONTINUOUS: 12.85V; VOLTAGE_MAX: 75V
R31 R104 R135 = HyTechDevices:RESISTOR_?_*: Resistor; DKPN: P470BYCT-ND; MANUFACTURER: Panasonic Electronic Components; MOPN: 667-ERJ-PA3F4700V; MPN: ERJ-PA3F4700V; POWER: 0.25W; RESISTANCE: 470; TOLERANCE: 1%; VOLTAGE_CONTINUOUS: 10.84V; VOLTAGE_MAX: 150V
R32 R105 = HyTechDevices:RESISTOR_?_*: Resistor; DKPN: P120DBCT-ND; MANUFACTURER: Panasonic Electronic Components; MOPN: 667-ERA-3AEB121V; MPN: ERA-3AEB121V; POWER: 0.1W; RESISTANCE: 120; TOLERANCE: 0.1%; VOLTAGE_CONTINUOUS: 3.46V; VOLTAGE_MAX: 75V
R33 R34 R37 R38 = HyTechDevices:RESISTOR_?_*: Resistor; DKPN: YAG4485CT-ND; MANUFACTURER: Yageo; MOPN: 603-RT0603BRD0718K7L; MPN: RT0603BRD0718K7L; POWER: 0.1W; RESISTANCE: 18.7k; TOLERANCE: 0.1%; VOLTAGE_CONTINUOUS: 43.24V; VOLTAGE_MAX: 75V
R35 R36 R39 R40 = HyTechDevices:RESISTOR_?_*: Resistor; DKPN: YAG4557CT-ND; MANUFACTURER: Yageo; MOPN: 603-RT0603BRD0743KL; MPN: RT0603BRD0743KL; POWER: 0.1W; RESISTANCE: 43k; TOLERANCE: 0.1%; VOLTAGE_CONTINUOUS: 65.57V; VOLTAGE_MAX: 75V
R41 R52 R60 R64 R85 = HyTechDevices:RESISTOR_?_*: Resistor; RESISTANCE: DNP
R42 R44 = HyTechDevices:RESISTOR_?_*: Resistor; DKPN: P20020CT-ND; MANUFACTURER: Panasonic Electronic Components; MOPN: 667-ERJ-PB3B2741V; MPN: ERJ-PB3B2741V; POWER: 0.2W; RESISTANCE: 2.74k; TOLERANCE: 0.1%; VOLTAGE_CONTINUOUS: 23.41V; VOLTAGE_MAX: 150V
R43 = HyTechDevices:RESISTOR_?_*: Resistor; DKPN: 311-100KHRTR-ND; MANUFACTURER: Yageo; MOPN: 603-RC0603FR-07100KL; MPN: RC0603FR-07100KL; POWER: 0.1W; RESISTANCE: 100k; TOLERANCE: 1%; VOLTAGE_CONTINUOUS: 75V; VOLTAGE_MAX: 75V
R46 R55-R57 R61 R62 R66 R67 R75 R77 R86-R88 R91 = HyTechDevices - Copy:RESISTOR_?_*: Resistor; DKPN: 311-10.0KHRCT-ND; MANUFACTURER: Yageo; MOPN: 603-RC0603FR-0710KL; MPN: RC0603FR-0710KL; POWER: 0.1W; RESISTANCE: 10k; TOLERANCE: 1%; VOLTAGE_CONTINUOUS: 31.62V; VOLTAGE_MAX: 75V
R49 = HyTechDevices:RESISTOR_?_*: Resistor; DKPN: P20340TR-ND; MANUFACTURER: Panasonic Electronic Components; MOPN: 667-ERJ-PB3D3301V; MPN: ERJ-PB3D3301V; POWER: 0.3W; RESISTANCE: 3.3k; TOLERANCE: 0.5%; VOLTAGE_CONTINUOUS: 25.69V; VOLTAGE_MAX: 150
R53 = HyTechDevices:RESISTOR_?_*: Resistor; DKPN: P5.9KDBCT-ND; MANUFACTURER: Panasonic Electronic Components; MOPN: 667-ERA-3AEB5901V; MPN: ERA-3AEB5901V; POWER: 0.1W; RESISTANCE: 5.9k; TOLERANCE: 0.1%; VOLTAGE_CONTINUOUS: 24.29V; VOLTAGE_MAX: 75V
R54 = HyTechDevices:RESISTOR_?_*: Resistor; DKPN: P11.5KDBCT-ND; MANUFACTURER: Panasonic Electronic Components; MOPN: 667-ERA-3AEB1152V; MPN: ERA-3AEB1152V; POWER: 0.1W; RESISTANCE: 11.5k; TOLERANCE: 0.1%; VOLTAGE_CONTINUOUS: 33.91V; VOLTAGE_MAX: 75V
R59 = HyTechDevices:RESISTOR_?_*: Resistor; DKPN: P330KDBCT-ND; MANUFACTURER: Panasonic Electronic Components; MOPN: 667-ERA-3AEB334V; MPN: ERA-3AEB334V; POWER: 0.1W; RESISTANCE: 330k; TOLERANCE: 0.1%; VOLTAGE_CONTINUOUS: 75V; VOLTAGE_MAX: 75V
R63 R84 = HyTechDevices:RESISTOR_?_*: Resistor; DKPN: RT0603BRB0714KL-ND; MANUFACTURER: YAGEO; MOPN: 603-RT0603BRB0714KL; MPN: RT0603BRB0714KL; POWER: 0.1W; RESISTANCE: 14k; TOLERANCE: 0.1%; VOLTAGE_CONTINUOUS: 37.4V; VOLTAGE_MAX: 75V
R68 = HyTechDevices:RESISTOR_?_*: Resistor; DKPN: 311-43.0KHRCT-ND; MANUFACTURER: Yageo; MOPN: 603-RC0603FR-0743KL; MPN: RC0603FR-0743KL; POWER: 0.1W; RESISTANCE: 43k; TOLERANCE: 1%; VOLTAGE_CONTINUOUS: 65.57V; VOLTAGE_MAX: 75V
R76 R78 = HyTechDevices - Copy:RESISTOR_?_*: Resistor; DKPN: 311-12.0KHRCT-ND; MANUFACTURER: Yageo; MOPN: 603-RC0603FR-0712KL; MPN: RC0603FR-0712KL; POWER: 0.1W; RESISTANCE: 12k; TOLERANCE: 1%; VOLTAGE_CONTINUOUS: 34.64V; VOLTAGE_MAX: 75V
R80 R82 = HyTechDevices - Copy:RESISTOR_?_*: Resistor; DKPN: P470BYCT-ND; MANUFACTURER: Panasonic Electronic Components; MOPN: 667-ERJ-PA3F4700V; MPN: ERJ-PA3F4700V; POWER: 0.25W; RESISTANCE: 470; TOLERANCE: 1%; VOLTAGE_CONTINUOUS: 10.84V; VOLTAGE_MAX: 150V
R90 = HyTechDevices:RESISTOR_?_*: Resistor; DKPN: P73.2KDBCT-ND; MANUFACTURER: Panasonic Electronic Components; MOPN: 667-ERA-3AEB7322V; MPN: ERA-3AEB7322V; POWER: 0.1W; RESISTANCE: 73.2k; TOLERANCE: 0.1%; VOLTAGE_CONTINUOUS: 75V; VOLTAGE_MAX: 75V
R92 = HyTechDevices:RESISTOR_?_*: Resistor; DKPN: 311-1.00MHRCT-ND; MANUFACTURER: Yageo; MOPN: 603-RC0603FR-071ML; MPN: RC0603FR-071ML; POWER: 0.1W; RESISTANCE: 1M; TOLERANCE: 1%; VOLTAGE_CONTINUOUS: 75V; VOLTAGE_MAX: 75V
R93 = HyTechDevices:RESISTOR_?_*: Resistor; DKPN: YAG4603TR-ND; MANUFACTURER: Yageo; MOPN: 603-RT0603BRD078K66L; MPN: RT0603BRD078K66L; POWER: 0.1W; RESISTANCE: 8.66k; TOLERANCE: 0.1%; VOLTAGE_CONTINUOUS: 29.43V; VOLTAGE_MAX: 75V
R111 = HyTechDevices:RESISTOR_?_*: Resistor; DKPN: P4.12KDBCT-ND; MANUFACTURER: Panasonic Electronic Components; MOPN: 667-ERA-3AEB4121V; MPN: ERA-3AEB4121V; POWER: 0.1W; RESISTANCE: 4.12k; TOLERANCE: 0.1%; VOLTAGE_CONTINUOUS: 20.30V; VOLTAGE_MAX: 75V
R122 R125 R126 R128 R131 R132 = HyTechDevices:RESISTOR_?_*: Resistor; DKPN: 311-12.0KHRCT-ND; MANUFACTURER: Yageo; MOPN: 603-RC0603FR-0712KL; MPN: RC0603FR-0712KL; POWER: 0.1W; RESISTANCE: 12k; TOLERANCE: 1%; VOLTAGE_CONTINUOUS: 34.64V; VOLTAGE_MAX: 75V
R123 R124 R129 R130 = HyTechDevices:RESISTOR_?_*: Resistor; DKPN: P20072CT-ND; MANUFACTURER: Panasonic Electronic Components; MOPN: 667-ERJ-PB3B7501V; MPN: ERJ-PB3B7501V; POWER: 0.2W; RESISTANCE: 7.5k; TOLERANCE: 0.1%; VOLTAGE_CONTINUOUS: 38.73V; VOLTAGE_MAX: 150V
T1 = HyTechDevices:TRANSFORMER: 2 Channel SMT Transformer Specs for both HM2102NL and HM2112ZNL Transformers Turns ratio: 1CT: 1CT Isolation Voltage: 4300 VDC Inductance: 150 uH Leakage Inductance: 0.50 uH max HM2102NLT: Datasheet <https://www.mouser.com/datasheet/2/336/HM2102NL-1218600.pdf> HM2112ZNLT: Datasheet <https://www.mouser.com/datasheet/2/336/HM2112ZNL-1224892.pdf>; DKPN: 1840-1036-1-ND; MANUFACTURER: Pulse Electronics; MOPN: 673-HM2112ZNLT; MPN: HM2112ZNLT
TD1 TD2 = HyTechDevices - Copy:CONNECTOR-2_?_*: 2 Pin Connector; MANUFACTURER: MOLEX; MPN: 436500217
TP_3.3V = HyTechDevices:TEST_POINT: Test Point for Probing; DKPN: 36-5015CT-ND; MANUFACTURER: Keystone Electronics; MOPN: 534-5015; MPN: 5015; SIGNAL: +3V3
TP_5V = HyTechDevices:TEST_POINT: Test Point for Probing; DKPN: 36-5015CT-ND; MANUFACTURER: Keystone Electronics; MOPN: 534-5015; MPN: 5015; SIGNAL: +5V
TP_12V = HyTechDevices:TEST_POINT: Test Point for Probing; DKPN: 36-5015CT-ND; MANUFACTURER: Keystone Electronics; MOPN: 534-5015; MPN: 5015; SIGNAL: +12V
TP_24V = HyTechDevices:TEST_POINT: Test Point for Probing; DKPN: 36-5015CT-ND; MANUFACTURER: Keystone Electronics; MOPN: 534-5015; MPN: 5015; SIGNAL: +24V
TP_GND = HyTechDevices:TEST_POINT: Test Point for Probing; DKPN: 36-5015CT-ND; MANUFACTURER: Keystone Electronics; MOPN: 534-5015; MPN: 5015; SIGNAL: GND
TP_TSAL_GREEN = HyTechDevices - Copy:TEST_POINT: Test Point; DKPN: 36-5015CT-ND; MANUFACTURER: Keystone Electronics; MOPN: 534-5015; MPN: 5015; SIGNAL: N$18
TP_TSAL_RED = HyTechDevices - Copy:TEST_POINT: Test Point; DKPN: 36-5015CT-ND; MANUFACTURER: Keystone Electronics; MOPN: 534-5015; MPN: 5015; SIGNAL: N$19
TSAL_GREEN = HyTechDevices:LED_?_*: LED; COLOR: Green; DKPN: 754-1790-1-ND; MANUFACTURER: Kingbright; MOPN: 604-APT1608ZGCK; MPN: APT1608ZGCK
TSB = HyTechDevices:CONNECTOR-8_?_*: 8 Pin Connector; DKPN: WM1798-ND; MANUFACTURER: Molex; MOPN: 538-43045-0814; MPN: 430450814
U1 = HyTechDevices:VOLTAGE_REGULATOR_?_*: Voltage Regulators LDL1117S50R Datasheet <https://www.mouser.com/datasheet/2/389/dm00366442-1799212.pdf> NCP785AH120T1G <https://www.mouser.com/datasheet/2/308/NCP785A_D-1812704.pdf> LMS8117A Datasheet <https://www.ti.com/lit/ds/symlink/lms8117a.pdf?HQS> ST732M50R Datasheet <https://www.mouser.com/datasheet/2/389/st732-1830546.pdf> LM2937IMPX-10/NOPB Datasheet <https://www.ti.com/lit/ds/symlink/lm2937.pdf>; DKPN: LMS8117AMP-3.3/NOPBCT-ND; MANUFACTURER: Texas Instruments; MOPN: 926-LMS8117AMP33NOPB; MPN: LMS8117AMP-3.3/NOPB
U4 U5 U8 U9 U11-U13 U16 U18 U22 U26 U33 = HyTechDevices:OPAMP_1_CHANNEL_*: Op-Amp 1 Channel OPA991 Datasheet <https://www.ti.com/lit/ds/symlink/opa991.pdf?ts=1615503614502> Note: OPA991 is also a comparator; DKPN: 296-OPA991IDCKRCT-ND; MANUFACTURER: Texas Instruments; MOPN: 595-OPA991IDCKR; MPN: OPA991IDCKR
U6 U10 = HyTechDevices:TCAN1051*V-Q1: TCAN1051*V Can Tranciever Datasheet <https://www.ti.com/lit/ds/symlink/tcan1051hgv-q1.pdf?HQS=dis-mous-null-mousermode-dsf-pf-null-wwe&ts=1610765132518&ref_url=https%253A%252F%252Fwww.mouser.com%252Ff>; DKPN: 296-49935-1-ND; MANUFACTURER: Texas Instruments; MOPN: 595-TCAN1051HGVDQ1; MPN: TCAN1051HGVDRQ1
U7 = HyTechDevices - Copy:LTC6820: LTC6820 isoSPI Isolated Communications Interface Datasheet <mouser.com/datasheet/2/609/LTC6820-1601976.pdf>; MANUFACTURER: Analog Devices; MPN: LTC6820IMS#PBF
U15 = HyTechDevices:*555: **555 Precision Timer NA555, NE555, SA555, SE555 <https://www.ti.com/lit/ds/symlink/na555.pdf> LM555 <https://www.ti.com/lit/ds/symlink/lm555.pdf>; DKPN: LM555CMX/NOPBCT-ND; MANUFACTURER: Texas Instruments; MOPN: 926-LM555CMX/NOPB; MPN: LM555CMX/NOPB
U17 U19 = HyTechDevices:OPAMP_2_CHANNEL_*: Op-Amp 2 Channel OPA2991 Datasheet <https://www.ti.com/lit/ds/symlink/opa2991.pdf?HQS=dis-mous-null-mousermode-dsf-pf-null-wwe&ts=1697521669896&ref_url=https%253A%252F%252Fwww.mouser.com%252F> Note: OPA2991 is also a comparator; DKPN: 296-OPA2991IDDFRCT-ND; MANUFACTURER: Texas Instruments; MOPN: 595-OPA2991IDDFR; MPN: OPA2991IDDFR
U20 = HyTechDevices:LOGICGATE_BUFFER: Buffer SN74LVC Datasheet <https://www.ti.com/lit/ds/symlink/sn74lvc1g34.pdf>; DKPN: 296-26604-2-ND; MANUFACTURER: Texas Instruments; MOPN: 595-SN74LVC1G34DCKT; MPN: SN74LVC1G34DCKT
U21 = HyTechDevices:ADM8316: ADM8316 Watchdog Datasheet <https://www.mouser.com/datasheet/2/609/adm8316_8318_8319_8320_8321_8322-1503275.pdf>; DKPN: ADM8316WBX30ARJZR7TR-ND; MANUFACTURER: Analog Devices Inc.; MOPN: 584-M8316WBX30ARJZR7; MPN: ADM8316WBX30ARJZR7; RESET_VOLTAGE: 3V; TIMEOUT: 102ms
U23-U25 = HyTechDevices:LOGICGATE_AND_: AND Gate SN74LVC Datasheet <https://www.ti.com/lit/ds/symlink/sn74lvc1g08.pdf>; DKPN: 296-SN74LVC1G08DCK3TR-ND; MANUFACTURER: Texas Instruments; MOPN: 595-SN74LVC1G08DCK3; MPN: SN74LVC1G08DCK3
U27 = HyTechDevices:ADG1423: ADG1423 Form-A/Form-C Analog Switch Datasheet <https://www.mouser.com/datasheet/2/609/ADG1421_1422_1423-1502752.pdf>; DKPN: ADG1423BRMZ-REEL7CT-ND; MANUFACTURER: Analog Devices Inc.; MOPN: 584-ADG1423BRMZ; MPN: ADG1423BRMZ
U32 = HyTechDevices:LTC6820: LTC6820 isoSPI Isolated Communications Interface Datasheet <mouser.com/datasheet/2/609/LTC6820-1601976.pdf>; MANUFACTURER: Analog Devices; MPN: LTC6820IMS#PBF
WATCHDOG = HyTechDevices:LED_?_*: LED; COLOR: Blue; DKPN: 754-1789-1-ND; MANUFACTURER: Kingbright; MOPN: 604-APT1608VBC/D; MPN: APT1608VBC/D
XF1 = HyTechDevices:FUSE_HOLDER_*: Fuse Holder All PNs for the holder; if Miniblade Fuses <https://www.littelfuse.com/media?resourcetype=datasheets&itemid=0f5f58cb-559e-494b-8d53-723f30445ae5&filename=littelfuse-mini-datasheet> needed, order separately. Mini-Blade PTH <https://www.mouser.com/datasheet/2/215/3568-742601.pdf> Mini-Blade SMD <https://www.mouser.com/datasheet/2/215/588-744913.pdf> Littelfuse 122 Fuse Holder and Fuse Fuse <https://www.littelfuse.com/~/media/electronics/datasheets/fuses/littelfuse_fuse_508_datasheet.pdf.pdf> Fuse Holder <https://www.littelfuse.com/~/media/electronics/datasheets/fuse_clips/littelfuse_fuse_clip_102_122_datasheet.pdf.pdf>; DKPN: 36-3568-ND; FUSE_TYPE: MINI 297; MANUFACTURER: Keystone; MOPN: 534-3568; MPN: 3568